# EAGLE design e-ink-display-v003 (EAGLE 7.3.0)
CNAME: e-ink-display; CREVISION: 0.0.3; DESIGNER: kennethlimcp

## Sheet 1 of 4: Power supply
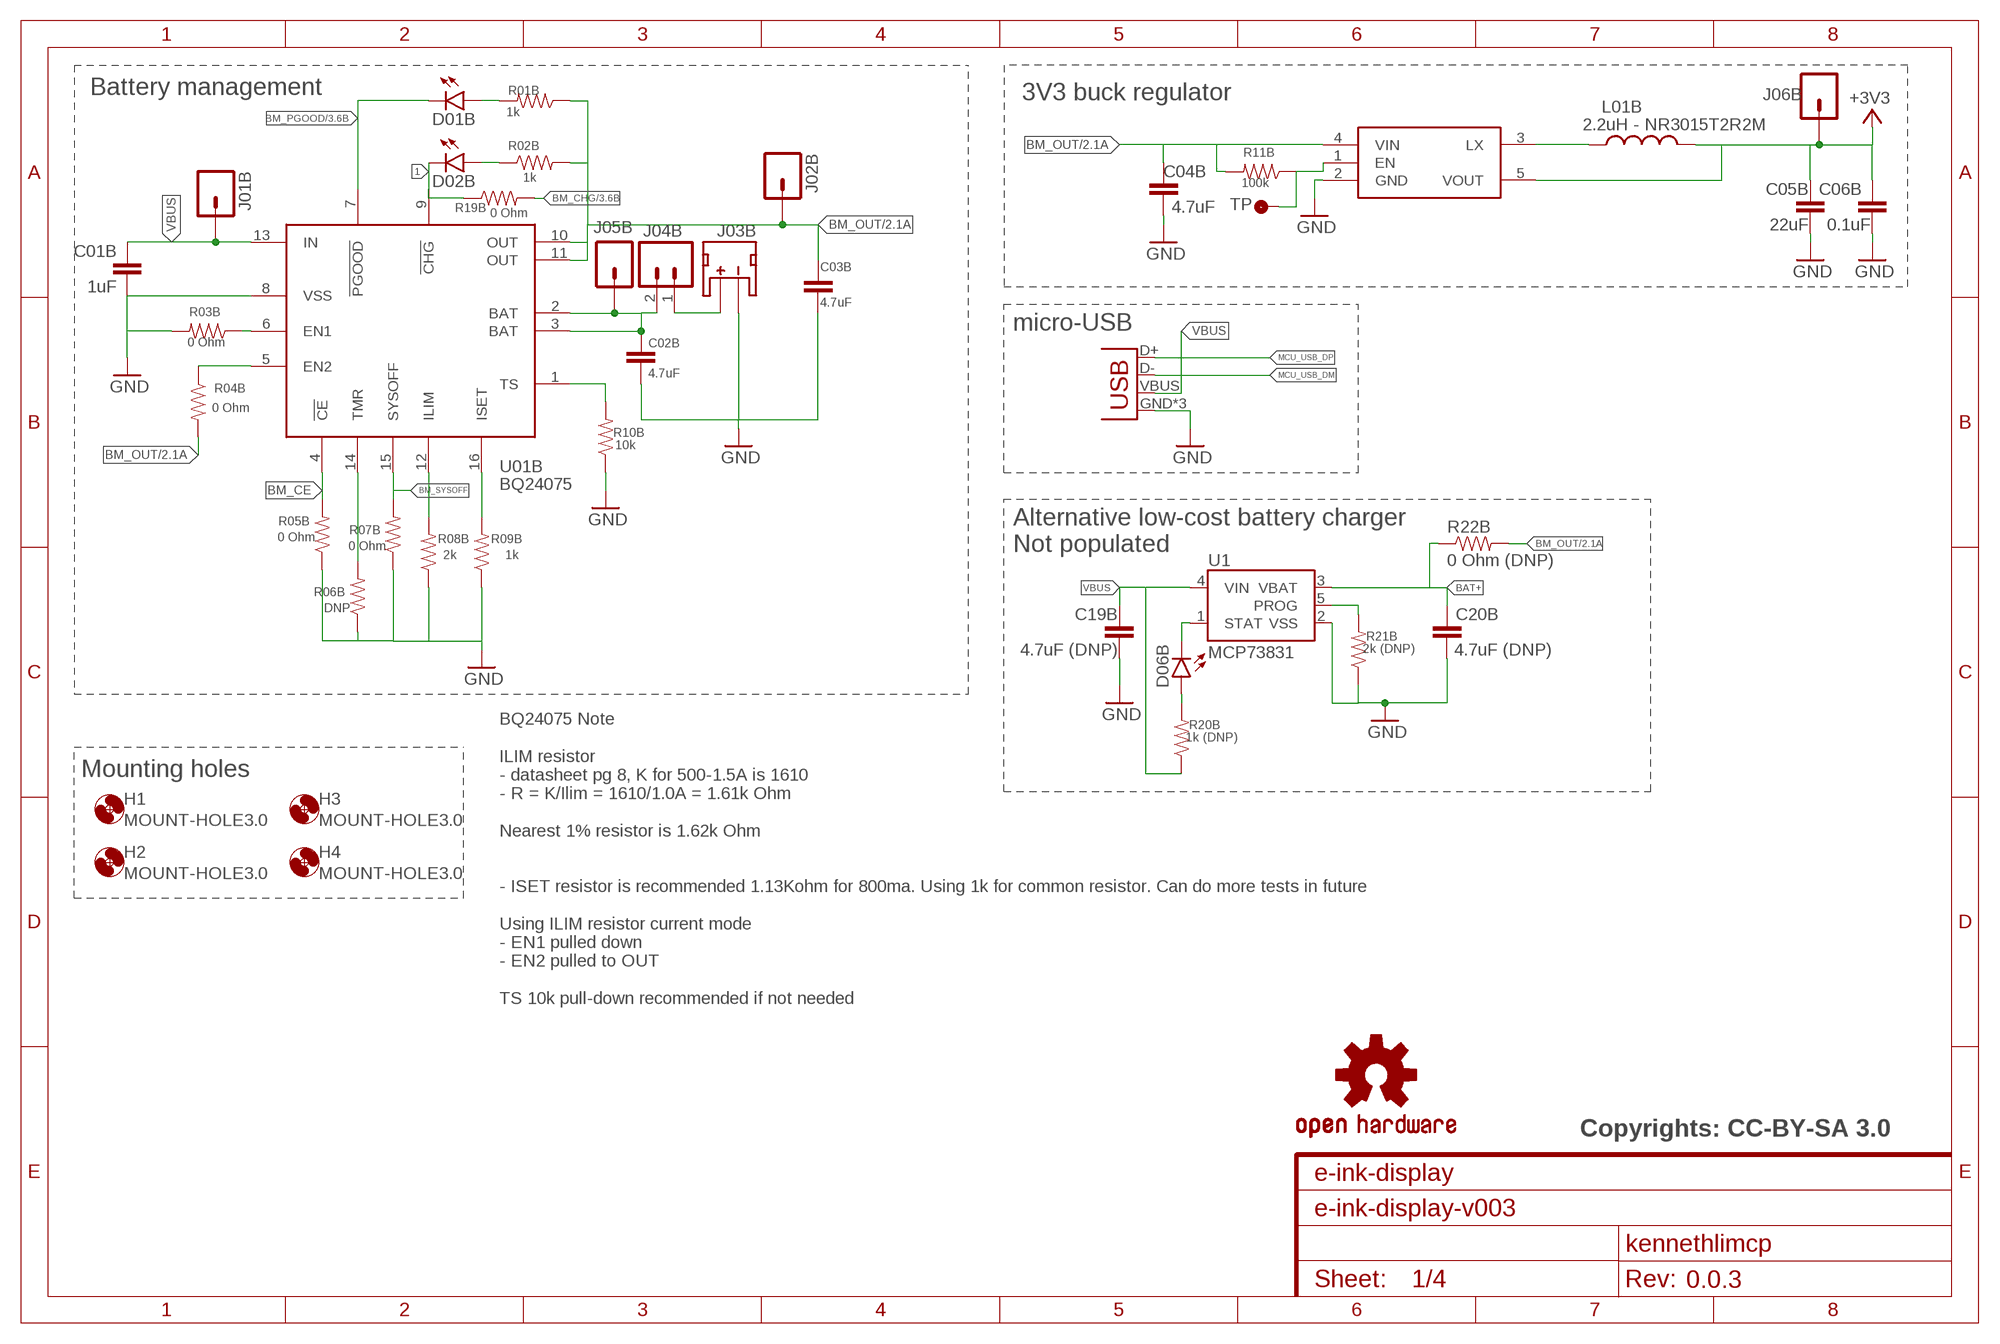
[diagram p0: schematic, sheet 1]

### Parts
C01B  1uF  CAP0603-CAP  [0603-CAP]
C02B  4.7uF  CAP0603-CAP  [0603-CAP]
C03B  4.7uF  CAP0603-CAP  [0603-CAP]
C04B  4.7uF  CAP0603-CAP  [0603-CAP]
C05B  22uF  CAP0603-CAP  [0603-CAP]
C06B  0.1uF  CAP0603-CAP  [0603-CAP]
C19B  4.7uF (DNP)  CAP0603-CAP  [0603-CAP]
C20B  4.7uF (DNP)  CAP0603-CAP  [0603-CAP]
D01B  LED0603  [LED-0603]
D02B  LED0603  [LED-0603]
D06B  LED0603  [LED-0603]
H1  MOUNT-HOLE3.0  [3,0]
H2  MOUNT-HOLE3.0  [3,0]
H3  MOUNT-HOLE3.0  [3,0]
H4  MOUNT-HOLE3.0  [3,0]
J01B  M01PTH  [1X01]
J02B  M01PTH  [1X01]
J03B  JST_2MM_MALE  [JST-2-SMD]
J04B  M02PTH  [1X02]
J05B  M01PTH  [1X01]
J06B  M01PTH  [1X01]
J07B  USBUSB-MICROB-SLOT-HOLE  [USB-MICROB-SLOT-HOLE]
L01B  2.2uH - NR3015T2R2M  INDUCTOR-SPARKFUNNR3015T4R7M  [INDUCTOR-NR3015]
LOGO1  OSHW-LOGOPAD  [OSHW-LOGO-M-PAD]
R01B  1k  RESISTOR0603-RES  [0603-RES]
R02B  1k  RESISTOR0603-RES  [0603-RES]
R03B  0 Ohm  RESISTOR0603-RES  [0603-RES]
R04B  0 Ohm  RESISTOR0603  [0603-RES]
R05B  0 Ohm  RESISTOR0603  [0603-RES]
R06B  DNP  RESISTOR0603  [0603-RES]
R07B  0 Ohm  RESISTOR0603  [0603-RES]
R08B  2k  RESISTOR0603  [0603-RES]
R09B  1k  RESISTOR0603-RES  [0603-RES]
R10B  10k  RESISTOR0603  [0603-RES]
R11B  100k  RESISTOR0603  [0603-RES]
R19B  0 Ohm  RESISTOR0603  [0603-RES]
R20B  1k (DNP)  RESISTOR0603  [0603-RES]
R21B  2k (DNP)  RESISTOR0603  [0603-RES]
R22B  0 Ohm (DNP)  RESISTOR1206  [1206]
TP01B  TP1  [TP35_BOT]
U1  MCP73831  [SOT23-5]
U01B  BQ24075  [QFN-16]
U02B  R8008-33  [SOT23-5]

### Nets
1: D02B.C R19B.1 U01B.9(!CHG)
+3V3: C05B.2 C06B.2 J06B.1 L01B.2 U02B.5(VOUT) ; also sheet 3,4
BAT+: C20B.2 J03B.2(+) J04B.1 R22B.1 U1.3(VBAT)
BM_BAT: C02B.2 J04B.2 J05B.1 U01B.2(BAT) U01B.3(BAT)
BM_CE: R05B.2 U01B.4(!CE)
BM_CHG: R19B.2 ; also sheet 3
BM_OUT: C03B.2 C04B.2 J02B.1 R01B.1 R02B.2 R04B.2 R11B.2 R22B.2 U01B.10(OUT) U01B.11(OUT) U02B.4(VIN) ; also sheet 2
BM_PGOOD: D01B.C U01B.7(!PGOOD) ; also sheet 3
BM_SYSOFF: R07B.2 U01B.15(SYSOFF)
GND: C01B.1 C02B.1 C03B.1 C04B.1 C05B.1 C06B.1 C19B.1 C20B.1 J03B.1(-) J07B.GND J07B.MT1(GND) J07B.MT2(GND) R03B.2 R05B.1 R06B.1 R07B.1 R08B.1 R09B.1 R10B.1 R21B.1 U1.2(VSS) U01B.8(VSS) U02B.2(GND) ; also sheet 2,3,4
MCU_USB_DM: J07B.D-
MCU_USB_DP: J07B.D+
N$4: R08B.2 U01B.12(ILIM)
N$9: R09B.2 U01B.16(ISET)
N$11: R04B.1 U01B.5(EN2)
N$12: R03B.1 U01B.6(EN1)
N$13: R06B.2 U01B.14(TMR)
N$15: R10B.2 U01B.1(TS)
N$17: D02B.A R02B.1
N$18: D01B.A R01B.2
N$19: R21B.2 U1.5(PROG)
N$21: R11B.1 TP01B.P$1(TP) U02B.1(EN)
N$23: L01B.1 U02B.3(LX)
N$30: D06B.C U1.1(STAT)
N$37: D06B.A R20B.2
VBUS: C01B.2 C19B.2 J01B.1 J07B.VBUS R20B.1 U1.4(VIN) U01B.13(IN)
Unconnected: J03B.NC1(PAD1) J03B.NC2(PAD2)

### Notes on the sheet
- Battery management | 3V3 buck regulator
- micro-USB
- Alternative low-cost battery charger
  Not populated
- Mounting holes
- BQ24075 Note
  
  ILIM resistor
  - datasheet pg 8, K for 500-1.5A is 1610
  - R = K/Ilim = 1610/1.0A = 1.61k Ohm
  
  Nearest 1% resistor is 1.62k Ohm
  
  
  - ISET resistor is recommended 1.13Kohm for 800ma. Using 1k for common resistor. Can do more tests in future
  
  Using ILIM resistor current mode
  - EN1 pulled down
  - EN2 pulled to OUT
  
  TS 10k pull-down recommended if not needed
- Copyrights: CC-BY-SA 3.0

## Sheet 2 of 4: e-ink power supply
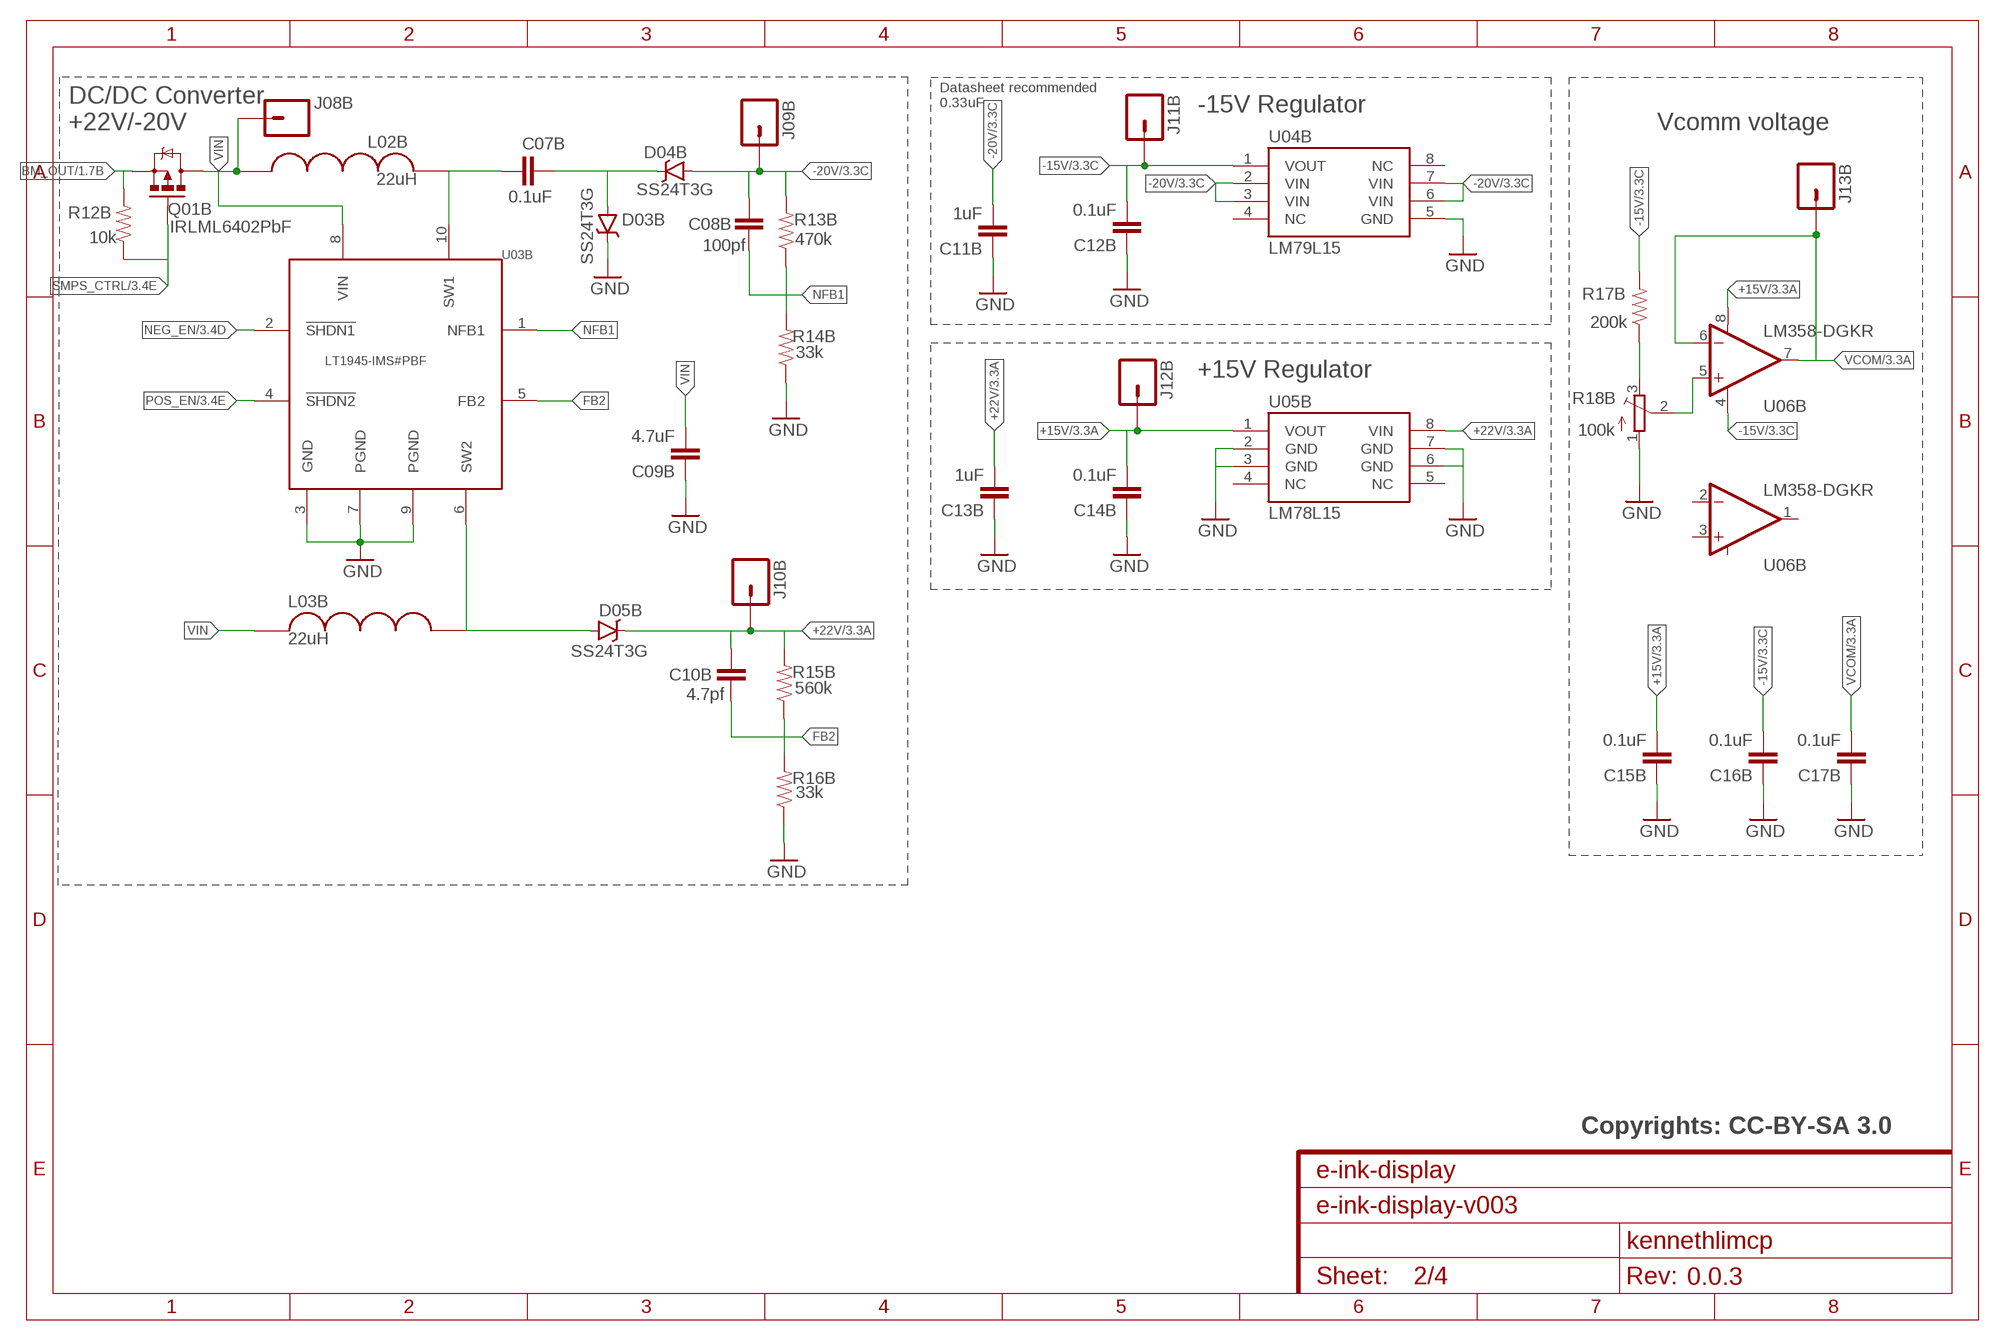
[diagram p1: schematic, sheet 2]

### Parts
C07B  0.1uF  CAP0603-CAP  [0603-CAP]
C08B  100pf  CAP0603-CAP  [0603-CAP]
C09B  4.7uF  CAP0603-CAP  [0603-CAP]
C10B  4.7pf  CAP0603-CAP  [0603-CAP]
C11B  1uF  CAP0603-CAP  [0603-CAP]
C12B  0.1uF  CAP0603-CAP  [0603-CAP]
C13B  1uF  CAP0603-CAP  [0603-CAP]
C14B  0.1uF  CAP0603-CAP  [0603-CAP]
C15B  0.1uF  CAP0603-CAP  [0603-CAP]
C16B  0.1uF  CAP0603-CAP  [0603-CAP]
C17B  0.1uF  CAP0603-CAP  [0603-CAP]
D03B  SS24T3G  [SMA-DIODE]
D04B  SS24T3G  [SMA-DIODE]
D05B  SS24T3G  [SMA-DIODE]
J08B  M01PTH  [1X01]
J09B  M01PTH  [1X01]
J10B  M01PTH  [1X01]
J11B  M01PTH  [1X01]
J12B  M01PTH  [1X01]
J13B  M01PTH  [1X01]
L02B  22uH  INDUCTOR  [4040(1515)]
L03B  22uH  INDUCTOR  [4040(1515)]
Q01B  IRLML6402PbF  MOSFET-PCHANNELSMD  [SOT23-3]
R12B  10k  RESISTOR0603  [0603-RES]
R13B  470k  RESISTOR0603  [0603-RES]
R14B  33k  RESISTOR0603  [0603-RES]
R15B  560k  RESISTOR0603  [0603-RES]
R16B  33k  RESISTOR0603  [0603-RES]
R17B  200k  RESISTOR0603  [0603-RES]
R18B  100k  TRIMPOTTC33X  [TC33X]
U03B  LT1945-IMS#PBF  [MSOP-10]
U04B  LM79L15  [SO08]
U05B  LM78L15  [SO08]
U06B  LM358-DGKR  [MSOP-8]

### Nets
+15V: C14B.2 C15B.2 J12B.1 U05B.1(VOUT) U06B.8(V+) ; also sheet 3
+22V: C10B.2 C13B.2 D05B.C J10B.1 R15B.2 U05B.8(VIN) ; also sheet 3
-15V: C12B.2 C16B.2 J11B.1 R17B.2 U04B.1(VOUT) U06B.4(V-) ; also sheet 3
-20V: C08B.2 C11B.2 D04B.A J09B.1 R13B.2 U04B.2(VIN) U04B.3(VIN) U04B.6(VIN) U04B.7(VIN) ; also sheet 3
BM_OUT: Q01B.2(S) R12B.2 ; also sheet 1
FB2: C10B.1 R15B.1 R16B.2 U03B.5(FB2)
GND: C09B.1 C11B.1 C12B.1 C13B.1 C14B.1 C15B.1 C16B.1 C17B.1 D03B.C R14B.1 R16B.1 R18B.1(A) U03B.3(GND) U03B.7(PGND) U03B.9(PGND) U04B.5(GND) U05B.2(GND) U05B.3(GND) U05B.6(GND) U05B.7(GND) ; also sheet 1,3,4
N$2: C07B.1 L02B.P$2 U03B.10(SW1)
N$3: C07B.2 D03B.A D04B.C
N$6: R18B.2(S) U06B.5(+IN2)
N$7: R17B.1 R18B.3(E)
N$8: D05B.A L03B.P$2 U03B.6(SW2)
NEG_EN: U03B.2(!SHDN1) ; also sheet 3
NFB1: C08B.1 R13B.1 R14B.2 U03B.1(NFB1)
POS_EN: U03B.4(!SHDN2) ; also sheet 3
SMPS_CTRL: Q01B.1(G) R12B.1 ; also sheet 3
VCOM: C17B.2 J13B.1 U06B.6(-IN2) U06B.7(OUT2) ; also sheet 3
VIN: C09B.2 J08B.1 L02B.P$1 L03B.P$1 Q01B.3(D) U03B.8(VIN)
Unconnected: U04B.4(NC) U04B.8(NC) U05B.4(NC) U05B.5(NC) U06B.1(OUT1) U06B.2(-IN1) U06B.3(+IN1)

### Notes on the sheet
- Datasheet recommended
  0.33uF
- -15V Regulator
- DC/DC Converter
  +22V/-20V
- Vcomm voltage
- +15V Regulator
- Copyrights: CC-BY-SA 3.0

## Sheet 3 of 4: e-ink display & MCU
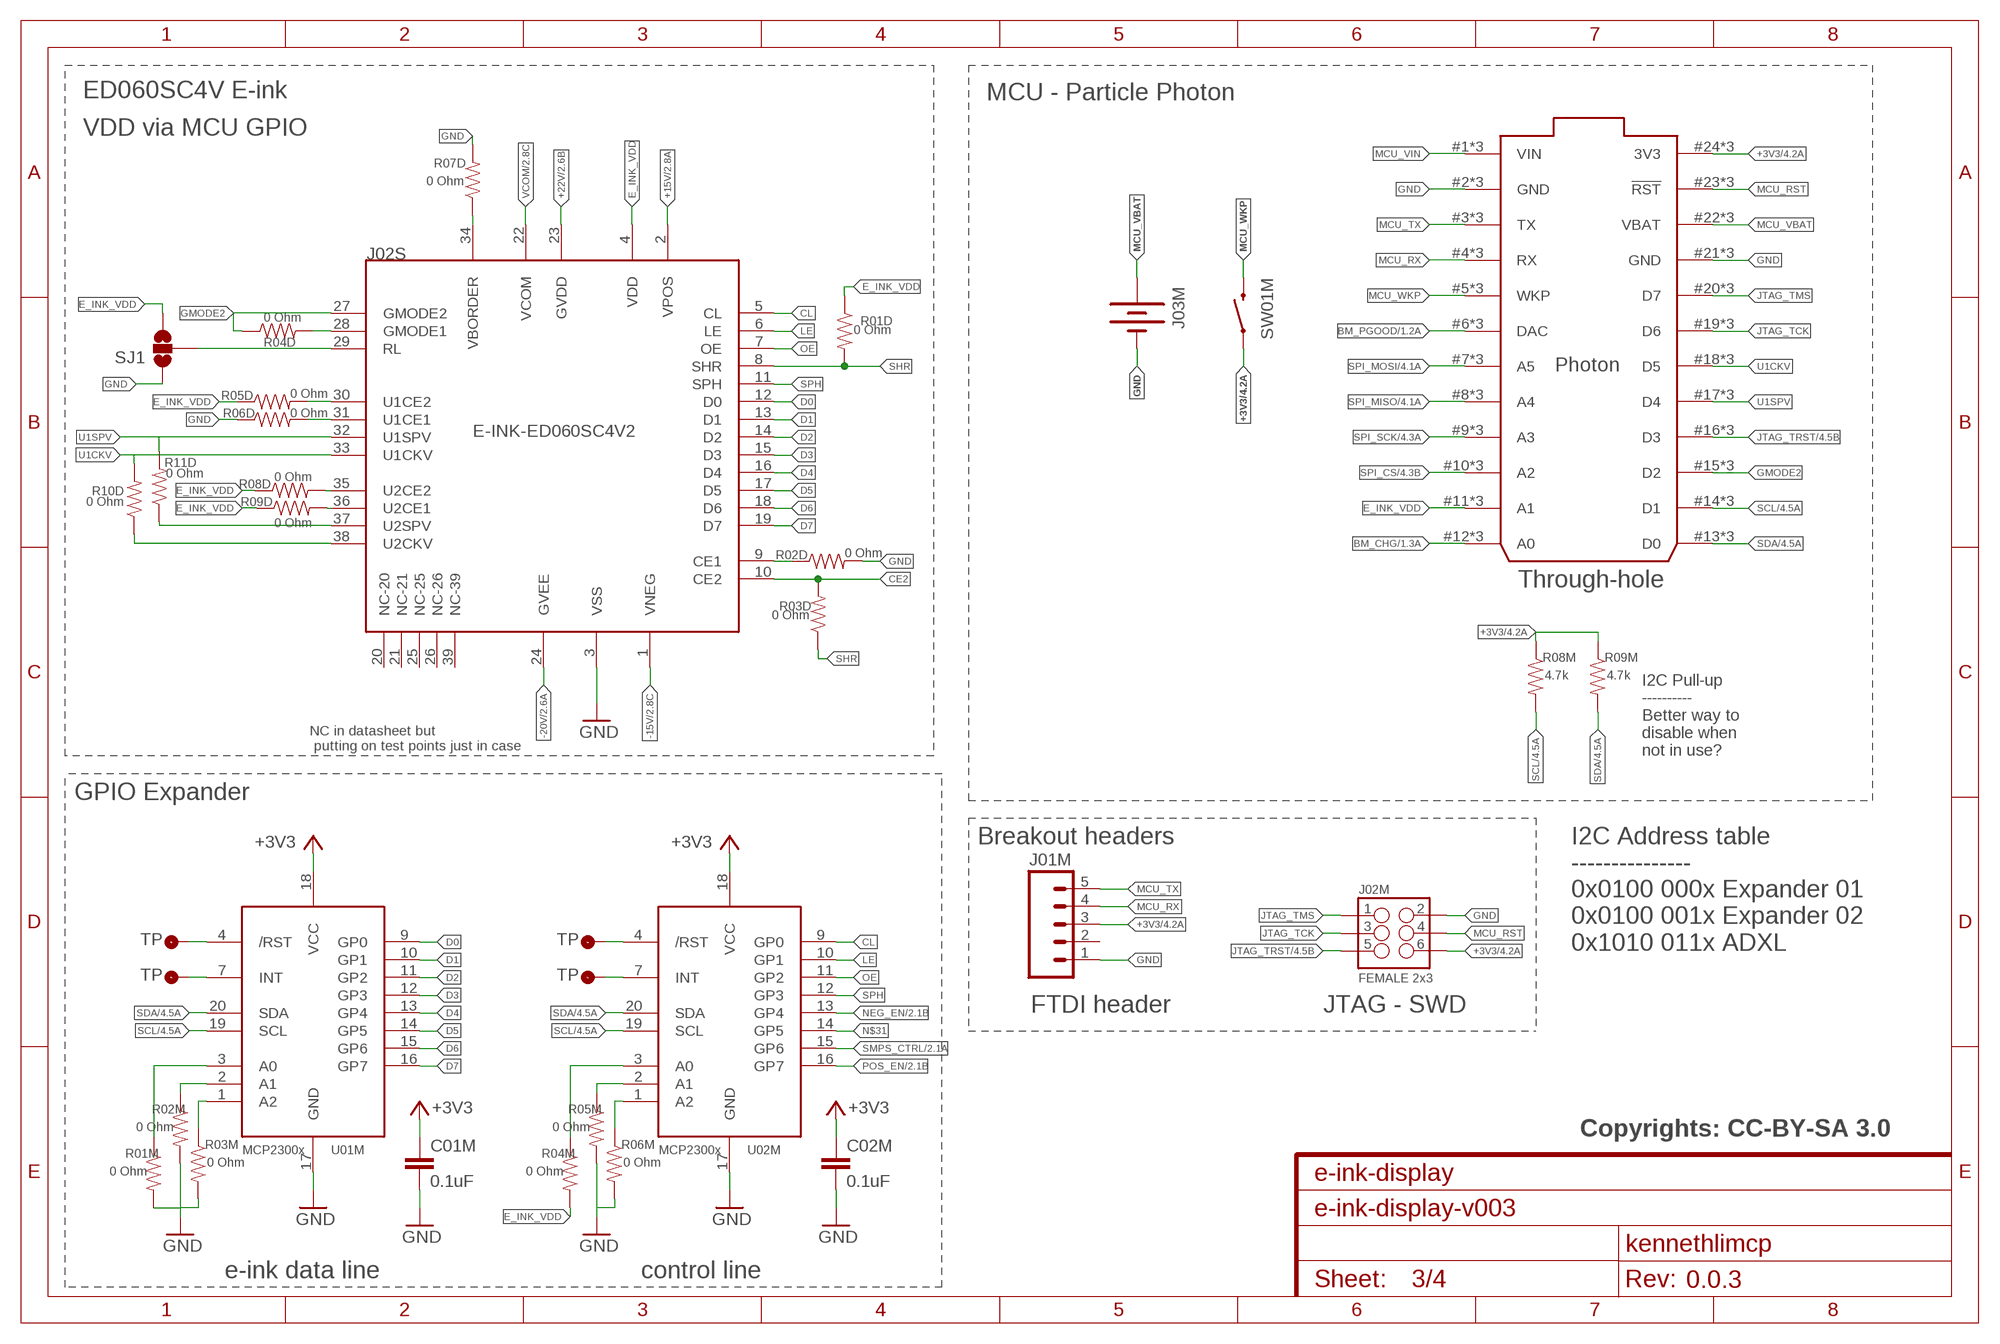
[diagram p2: schematic, sheet 3]

### Parts
C01M  0.1uF  CAP0603-CAP  [0603-CAP]
C02M  0.1uF  CAP0603-CAP  [0603-CAP]
J01M  M05PTH  [1X05]
J02M  FEMALE 2x3  M03X2FEMALE  [2X3]
J02S  E-INK-ED060SC4V2  [FPC-0.3-39]
J03M  BATTERY20PTH  [BATTCOM_20MM_PTH]
R01D  0 Ohm  RESISTOR0603-RES  [0603-RES]
R01M  0 Ohm  RESISTOR0603-RES  [0603-RES]
R02D  0 Ohm  RESISTOR0603-RES  [0603-RES]
R02M  0 Ohm  RESISTOR0603-RES  [0603-RES]
R03D  0 Ohm  RESISTOR0603-RES  [0603-RES]
R03M  0 Ohm  RESISTOR0603-RES  [0603-RES]
R04D  0 Ohm  RESISTOR0603-RES  [0603-RES]
R04M  0 Ohm  RESISTOR0603-RES  [0603-RES]
R05D  0 Ohm  RESISTOR0603-RES  [0603-RES]
R05M  0 Ohm  RESISTOR0603-RES  [0603-RES]
R06D  0 Ohm  RESISTOR0603-RES  [0603-RES]
R06M  0 Ohm  RESISTOR0603-RES  [0603-RES]
R07D  0 Ohm  RESISTOR0603-RES  [0603-RES]
R08D  0 Ohm  RESISTOR0603-RES  [0603-RES]
R08M  4.7k  RESISTOR0603-RES  [0603-RES]
R09D  0 Ohm  RESISTOR0603-RES  [0603-RES]
R09M  4.7k  RESISTOR0603-RES  [0603-RES]
R10D  0 Ohm  RESISTOR0603-RES  [0603-RES]
R11D  0 Ohm  RESISTOR0603-RES  [0603-RES]
SJ1  SOLDERJUMPER_2WAYT  [SJ_2]
SW01M  SWITCH-MOMENTARY-2PTH  [TACTILE-PTH]
U01M  MCP2300X/QFN  [QFN-20(4X4)]
U02M  MCP2300X/QFN  [QFN-20(4X4)]
U03M  PHOTON_WITH_STACKABLE_HEADERS  [PHOTON_STACKABLE]
U$1  TP1  [TP35_BOT]
U$2  TP1  [TP35_BOT]
U$3  TP1  [TP35_BOT]
U$4  TP1  [TP35_BOT]

### Nets
+3V3: C01M.1 C02M.1 J01M.3 J02M.6 R08M.1 R09M.1 SW01M.1 U01M.18(VCC) U02M.18(VCC) U03M.24(3V3) U03M.#24(3V3) U03M.@24(3V3) ; also sheet 1,4
+15V: J02S.2(VPOS) ; also sheet 2
+22V: J02S.23(GVDD) ; also sheet 2
-15V: J02S.1(VNEG) ; also sheet 2
-20V: J02S.24(GVEE) ; also sheet 2
BM_CHG: U03M.12(A0) U03M.#12(A0) U03M.@12(A0) ; also sheet 1
BM_PGOOD: U03M.6(DAC) U03M.#6(DAC) U03M.@6(DAC) ; also sheet 1
CE2: J02S.10(CE2) R03D.2
CL: J02S.5(CL) U02M.9(GP0)
D0: J02S.12(D0) U01M.9(GP0)
D1: J02S.13(D1) U01M.10(GP1)
D2: J02S.14(D2) U01M.11(GP2)
D3: J02S.15(D3) U01M.12(GP3)
D4: J02S.16(D4) U01M.13(GP4)
D5: J02S.17(D5) U01M.14(GP5)
D6: J02S.18(D6) U01M.15(GP6)
D7: J02S.19(D7) U01M.16(GP7)
E_INK_VDD: J02S.4(VDD) R01D.1 R04M.2 R05D.1 R08D.1 R09D.1 SJ1.3 U03M.11(A1) U03M.#11(A1) U03M.@11(A1)
GMODE2: J02S.27(GMODE2) R04D.1 U03M.15(D2) U03M.#15(D2) U03M.@15(D2)
GND: C01M.2 C02M.2 J01M.1 J02M.2 J02S.3(VSS) J03M.2(-) R01M.2 R02D.2 R02M.2 R03M.2 R05M.2 R06D.1 R06M.2 R07D.2 SJ1.1 U01M.17(GND) U02M.17(GND) U03M.2(GND) U03M.21(GND) U03M.#2(GND) U03M.#21(GND) U03M.@2(GND) U03M.@21(GND) ; also sheet 1,2,4
JTAG_TCK: J02M.3 U03M.19(D6) U03M.#19(D6) U03M.@19(D6)
JTAG_TMS: J02M.1 U03M.20(D7) U03M.#20(D7) U03M.@20(D7)
JTAG_TRST: J02M.5 U03M.16(D3) U03M.#16(D3) U03M.@16(D3) ; also sheet 4
LE: J02S.6(LE) U02M.10(GP1)
MCU_RST: J02M.4 U03M.23(!RST) U03M.#23(!RST) U03M.@23(!RST)
MCU_RX: J01M.4 U03M.4(RX) U03M.#4(RX) U03M.@4(RX)
MCU_TX: J01M.5 U03M.3(TX) U03M.#3(TX) U03M.@3(TX)
MCU_VBAT: J03M.1(+) U03M.22(VBAT) U03M.#22(VBAT) U03M.@22(VBAT)
MCU_VIN: U03M.1(VIN) U03M.#1(VIN) U03M.@1(VIN)
MCU_WKP: SW01M.3 U03M.5(WKP) U03M.#5(WKP) U03M.@5(WKP)
N$1: J02S.28(GMODE1) R04D.2
N$5: J02S.31(U1CE1) R06D.2
N$14: U01M.4(/RST) U$1.P$1(TP)
N$16: U01M.7(INT) U$2.P$1(TP)
N$20: U02M.4(/RST) U$3.P$1(TP)
N$22: U02M.7(INT) U$4.P$1(TP)
N$24: R03M.1 U01M.1(A2)
N$25: R01M.1 U01M.3(A0)
N$26: J02S.35(U2CE2) R08D.2
N$27: J02S.36(U2CE1) R09D.2
N$28: J02S.9(CE1) R02D.1
N$29: J02S.34(VBORDER) R07D.1
N$31: U02M.14(GP5)
N$32: R06M.1 U02M.1(A2)
N$33: R05M.1 U02M.2(A1)
N$34: R04M.1 U02M.3(A0)
N$35: R02M.1 U01M.2(A1)
NEG_EN: U02M.13(GP4) ; also sheet 2
OE: J02S.7(OE) U02M.11(GP2)
POS_EN: U02M.16(GP7) ; also sheet 2
RL: J02S.29(RL) SJ1.2
SCL: R08M.2 U01M.19(SCL) U02M.19(SCL) U03M.14(D1) U03M.#14(D1) U03M.@14(D1) ; also sheet 4
SDA: R09M.2 U01M.20(SDA) U02M.20(SDA) U03M.13(D0) U03M.#13(D0) U03M.@13(D0) ; also sheet 4
SHR: J02S.8(SHR) R01D.2 R03D.1
SMPS_CTRL: U02M.15(GP6) ; also sheet 2
SPH: J02S.11(SPH) U02M.12(GP3)
SPI_CS: U03M.10(A2) U03M.#10(A2) U03M.@10(A2) ; also sheet 4
SPI_MISO: U03M.8(A4) U03M.#8(A4) U03M.@8(A4) ; also sheet 4
SPI_MOSI: U03M.7(A5) U03M.#7(A5) U03M.@7(A5) ; also sheet 4
SPI_SCK: U03M.9(A3) U03M.#9(A3) U03M.@9(A3) ; also sheet 4
U1CE2: J02S.30(U1CE2) R05D.2
U1CKV: J02S.33(U1CKV) R10D.2 U03M.18(D5) U03M.#18(D5) U03M.@18(D5)
U1SPV: J02S.32(U1SPV) R11D.2 U03M.17(D4) U03M.#17(D4) U03M.@17(D4)
U2CKV: J02S.38(U2CKV) R10D.1
U2SPV: J02S.37(U2SPV) R11D.1
VCOM: J02S.22(VCOM) ; also sheet 2
Unconnected: J01M.2 J02S.20(NC-20) J02S.21(NC-21) J02S.25(NC-25) J02S.26(NC-26) J02S.39(NC-39)

### Notes on the sheet
- MCU - Particle Photon
- ED060SC4V E-ink
  
  VDD via MCU GPIO
- Through-hole
- NC in datasheet but
   putting on test points just in case
- I2C Pull-up
  ----------
  Better way to 
  disable when 
  not in use?
- GPIO Expander
- Breakout headers
- I2C Address table
  ---------------
  0x0100 000x Expander 01
  0x0100 001x Expander 02
  0x1010 011x ADXL
- FTDI header | JTAG - SWD
- Copyrights: CC-BY-SA 3.0
- e-ink data line | control line

## Sheet 4 of 4: Peripherals
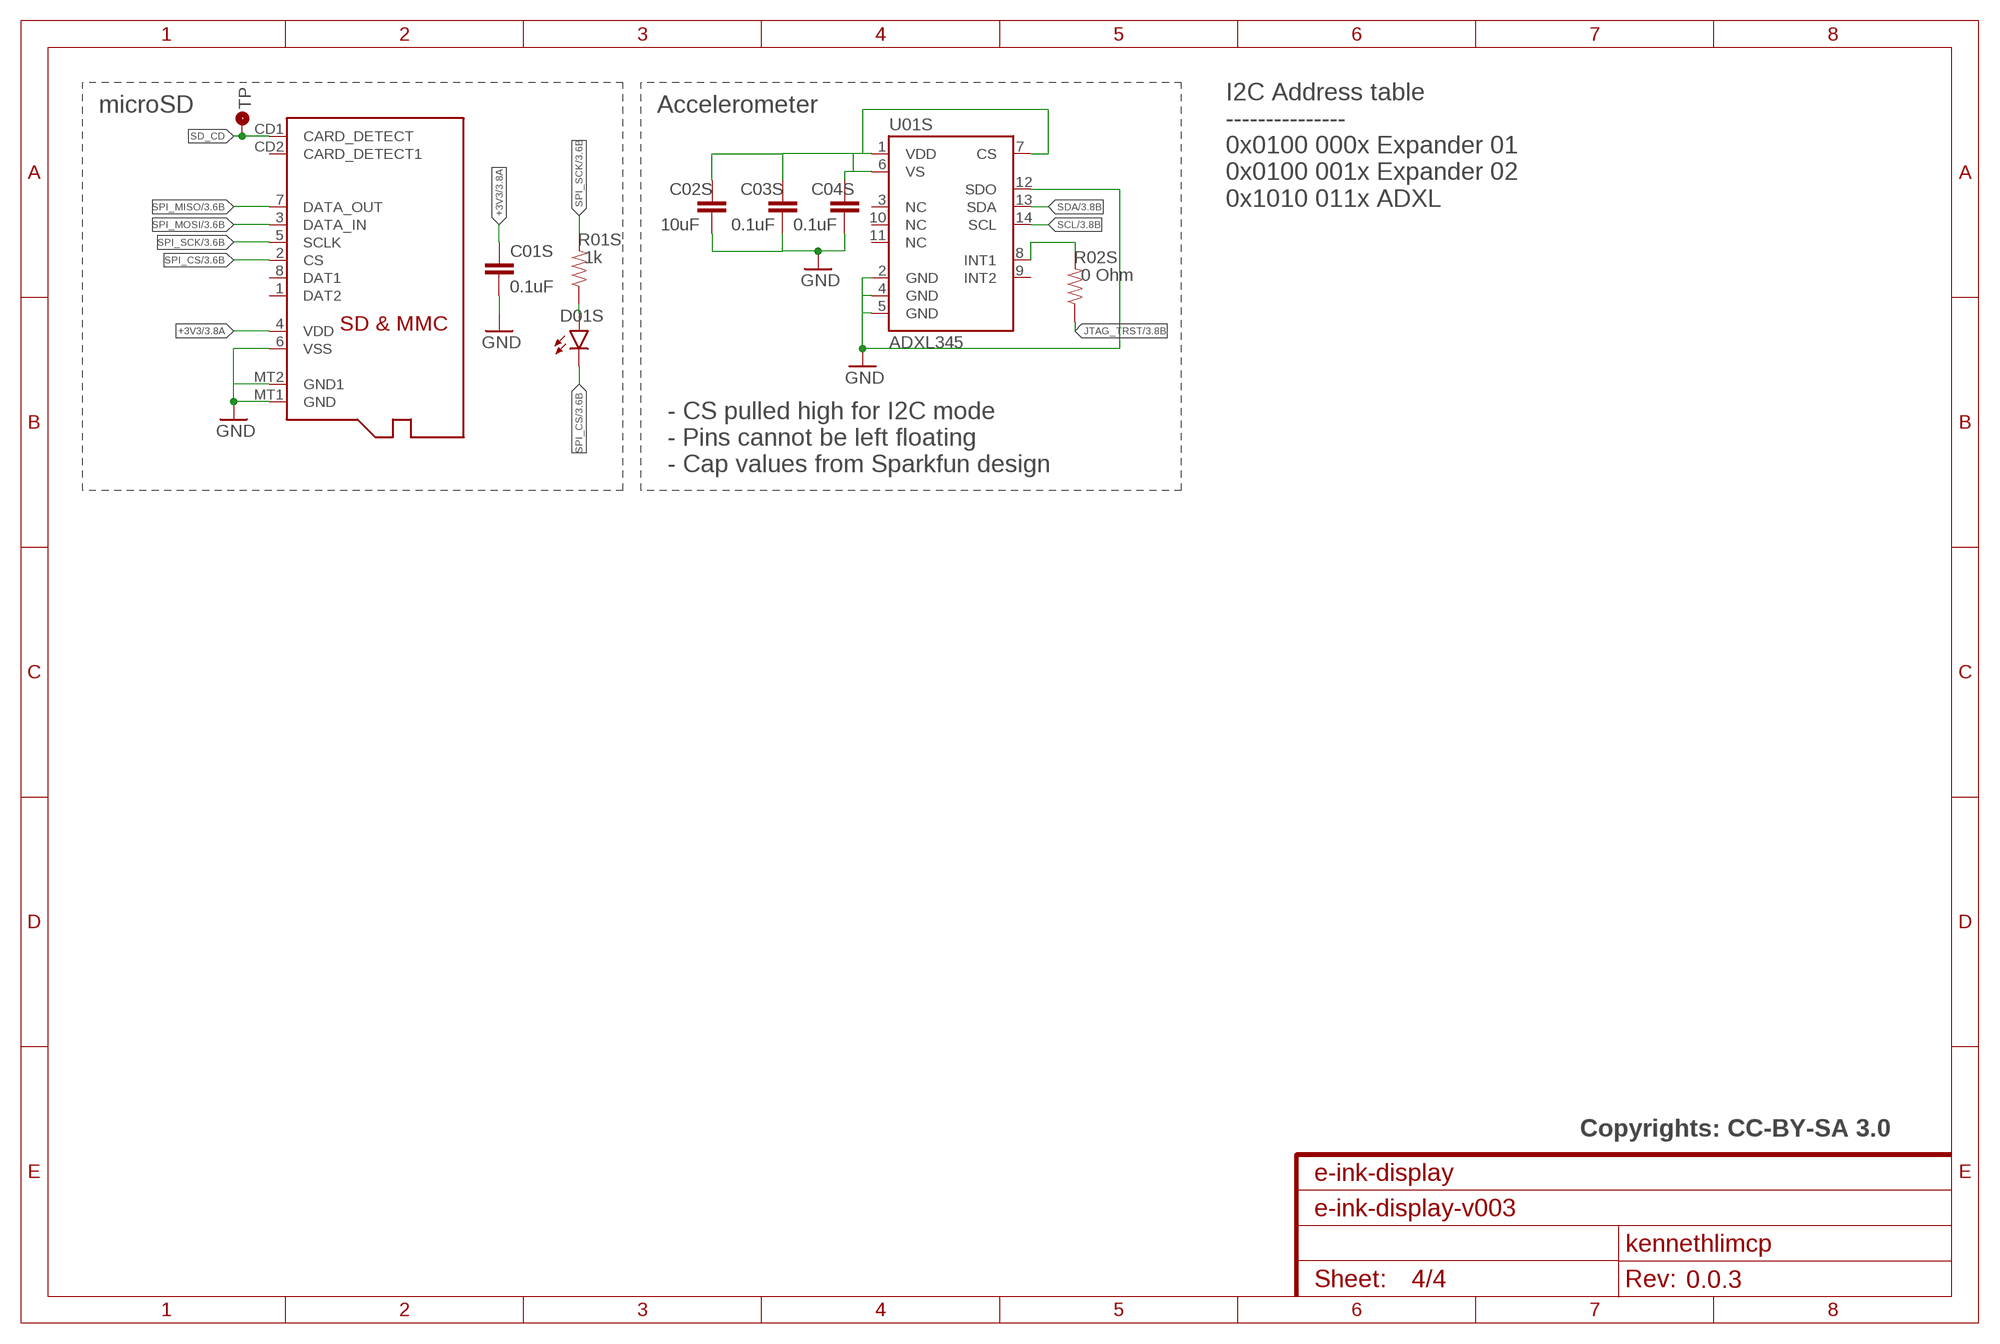
[diagram p3: schematic, sheet 4]

### Parts
C01S  0.1uF  CAP0603-CAP  [0603-CAP]
C02S  10uF  CAP0603-CAP  [0603-CAP]
C03S  0.1uF  CAP0603-CAP  [0603-CAP]
C04S  0.1uF  CAP0603-CAP  [0603-CAP]
D01S  LED0603  [LED-0603]
J01S  MICROSD  [MICROSD]
R01S  1k  RESISTOR0603-RES  [0603-RES]
R02S  0 Ohm  RESISTOR0603  [0603-RES]
U01S  ADXL345  [LGA14]
U$5  TP3  [TP60_BOT]

### Nets
+3V3: C01S.1 J01S.4(VDD) ; also sheet 1,3
GND: C01S.2 C02S.2 C03S.2 C04S.2 J01S.6(VSS) J01S.MT1(GND) J01S.MT2(GND1) U01S.2(GND) U01S.4(GND) U01S.5(GND) U01S.12(SDO) ; also sheet 1,2,3
JTAG_TRST: R02S.1 ; also sheet 3
N$10: R02S.2 U01S.8(INT1)
N$36: C02S.1 C03S.1 C04S.1 U01S.1(VDD) U01S.6(VS) U01S.7(CS)
R01S: D01S.A R01S.1
SCL: U01S.14(SCL) ; also sheet 3
SD_CD: J01S.CD1(CARD_DETECT) U$5.P$1(TP)
SDA: U01S.13(SDA) ; also sheet 3
SPI_CS: D01S.C J01S.2(CS) ; also sheet 3
SPI_MISO: J01S.7(DATA_OUT) ; also sheet 3
SPI_MOSI: J01S.3(DATA_IN) ; also sheet 3
SPI_SCK: J01S.5(SCLK) R01S.2 ; also sheet 3
Unconnected: J01S.1(DAT2) J01S.8(DAT1) J01S.CD2(CARD_DETECT1) U01S.3(NC) U01S.9(INT2) U01S.10(NC) U01S.11(NC)

### Notes on the sheet
- microSD | Accelerometer
- I2C Address table
  ---------------
  0x0100 000x Expander 01
  0x0100 001x Expander 02
  0x1010 011x ADXL
- - CS pulled high for I2C mode
  - Pins cannot be left floating
  - Cap values from Sparkfun design
- Copyrights: CC-BY-SA 3.0

## Library data of the parts
C01B C01M C01S C02B C02M C02S C03B C03S C04B C04S C05B C06B C07B C08B C09B C10B C11B C12B C13B C14B C15B C16B C17B C19B C20B = SparkFun-Capacitors:CAP: Capacitor Standard 0603 ceramic capacitor, and 0.1" leaded capacitor.
D01B D01S D02B D06B = SparkFun-LED:LED: LEDs Standard schematic elements and footprints for 5mm, 3mm, 1206, and 0603 sized LEDs. 5mm - Spark Fun Electronics SKU : COM-00529 (and others)
D03B D04B D05B = kennethlimcp:SS24T3G: SS24T3G, Schottky diode 40V, 1A, Vf 500mV Package: DO-214AA
H1-H4 = holes:MOUNT-HOLE: MOUNTING HOLE with drill center marker
J01B J02B J05B J06B J08B J09B J10B J11B J12B J13B = SparkFun-Connectors:M01: Header 1 Standard 1-pin 0.1" header. Use with straight break away headers (SKU : PRT-00116), right angle break away headers (PRT-00553), swiss pins (PRT-00743), machine pins (PRT-00117), and female headers (PRT-00115).
J01M = SparkFun-Connectors:M05: Header 5 Standard 5-pin 0.1" header. Use with straight break away headers (SKU : PRT-00116), right angle break away headers (PRT-00553), swiss pins (PRT-00743), machine pins (PRT-00117), and female headers (PRT-00115). Molex polarized connector foot print use with SKU : PRT-08230 with associated crimp pins and housings.
J01S = adafruit:MICROSD: Micro-SD / Transflash card holder with SPI pinout For the 3M # 2908-05WB-MG and/or 4UCON #19656 push-push type
J02M = SparkFun-Connectors:M03X2: 2x3 .1" header. Shrouded, with keying- CONN-10681 SMT- CONN-11415 Pogo pins- HW-11044; PROD_ID: CONN-11566
J02S = kennethlimcp:E-INK-ED060SC4V2
J03B = SparkFun-Connectors:JST_2MM_MALE: Mates to single-cell LiPo batteries. CONN-11443 Now with smashable polarity marks!; BTM_NEG: -; BTM_POS: +; PROD_ID: CONN-11443; TOP_NEG: -; TOP_POS: +
J03M = SparkFun-Electromechanical:BATTERY: Battery Holders Various common sizes : AA, AAA, 18650 (PRT-12895), 20mm coin cell and 12mm coin cell. 20MM_4LEGS, BATT-10373
J04B = SparkFun-Connectors:M02: Standard 2-pin 0.1" header. Use with - straight break away headers ( PRT-00116) - right angle break away headers (PRT-00553) - swiss pins (PRT-00743) - machine pins (PRT-00117) - female headers (PRT-00115) Molex polarized connector foot print use with: PRT-08233 with associated crimp pins and housings. 2.54_SCREWTERM for use with PRT-10571. 3.5mm Screw Terminal footprints for PRT-08084 5mm Screw Terminal footprints for use with PRT-08432
J07B = Spark:USB
L01B = Spark:INDUCTOR-SPARKFUN: Inductors Basic Inductor/Choke - 0603 and 1206. Footprints are not proven and vary greatly between part numbers. SRN6045- 33uH, 20% 1.4A; NR3015T4R7M: 4.7uH
L02B L03B = kennethlimcp:INDUCTOR
LOGO1 = kennethlimcp:OSHW-LOGO: Open Source Hardware Logo This logo indicates the piece of hardware it is found on incorporates a OSHW license and/or adheres to the definition of open source hardware found here: http://freedomdefined.org/OSHW
Q01B = SparkFun-DiscreteSemi:MOSFET-PCHANNEL: Generic PMOSFET IRLML2244 - TRANS-11153 (SOT-23 -20V -4.3A) (1.Gate 2.Source 3.Drain) FQP27P06 - COM-10349 <http://www.sparkfun.com/products/10349> (TO-220 -60V -27A) (1.Gate 2.Source 3.Drain)
R01B R01S R02B R02S R03B R04B R05B R06B R07B R08B R09B R10B R11B R12B R13B R14B R15B R16B R17B R19B R20B R21B R22B = SparkFun-Resistors:RESISTOR: Resistor Basic schematic elements and footprints for 0603, 1206, and PTH resistors.
R01D R01M R02D R02M R03D R03M R04D R04M R05D R05M R06D R06M R07D R08D R08M R09D R09M R10D R11D = SparkFun-Passives:RESISTOR: Resistor Basic schematic elements and footprints for 0603, 1206, and PTH resistors.
R18B = adafruit:TRIMPOT: SMT trimmer potentiometer part number TC33X http://www.ladyada.net/library/eagle
SJ1 = SparkFun-Retired:SOLDERJUMPER_2WAY: Solder Jumper 2 way solder jumper
SW01M = SparkFun-Electromechanical:SWITCH-MOMENTARY-2: Various NO switches- pushbuttons, reed, etc; PROD_ID: SWCH-08441
TP01B U$1-U$5 = Spark:TP: Test Points of all sizes and shapes
U1 = SparkFun-PowerIC:MCP73831: Miniature single cell, fully integrated Li-Ion, Li-polymer charge management controller http://ww1.microchip.com/downloads/en/DeviceDoc/20001984g.pdf IC-09995; PROD_ID: IC-09995
U01B = kennethlimcp:BQ2407: 1.5-A USB-Friendly Li-Ion Battery Charger and Power-Path Management IC Series: bq24072, bq24073, bq24074, bq24075, bq24079
U01M U02M = kennethlimcp:MCP2300X: MCP23008 Inexpensive i2c i/o expander - 8 general purpose i/o pins with optional pullups
U01S = SparkFun-Sensors:ADXL345: 3-axis SPI/I2C 2/4/8/16g accelerometer
U02B = Spark:R8008-33
U03B = kennethlimcp:LT1945: LT1945 36V switch, 350mA, Dual micropower DC/DC converter
U03M = Spark:PHOTON
U04B = kennethlimcp:LM79L15: LM79L15, SOIC-8
U05B = kennethlimcp:LM78L15: LM78L15, SOIC-8
U06B = kennethlimcp:LM358: LM358, two independent, high-gain, Wide Supply Ranges frequency-compensated operational amplifiers MSOP-8

## Net classes
0 default: clearance 0.205 mm

## Board
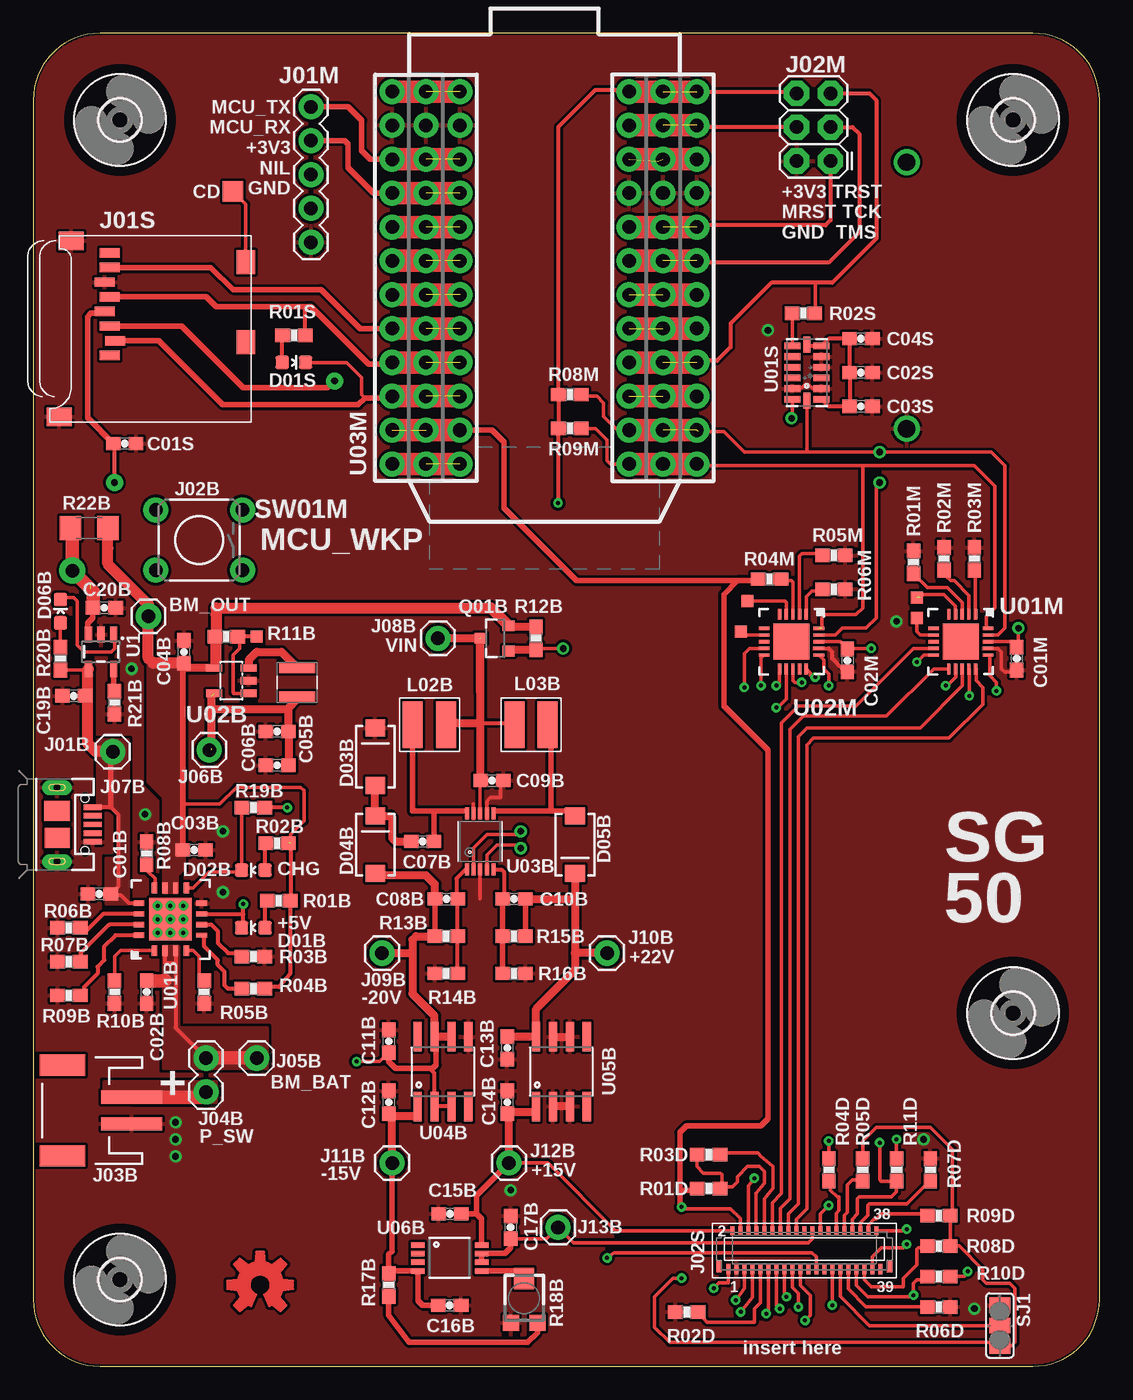
[diagram p4: board, top side]
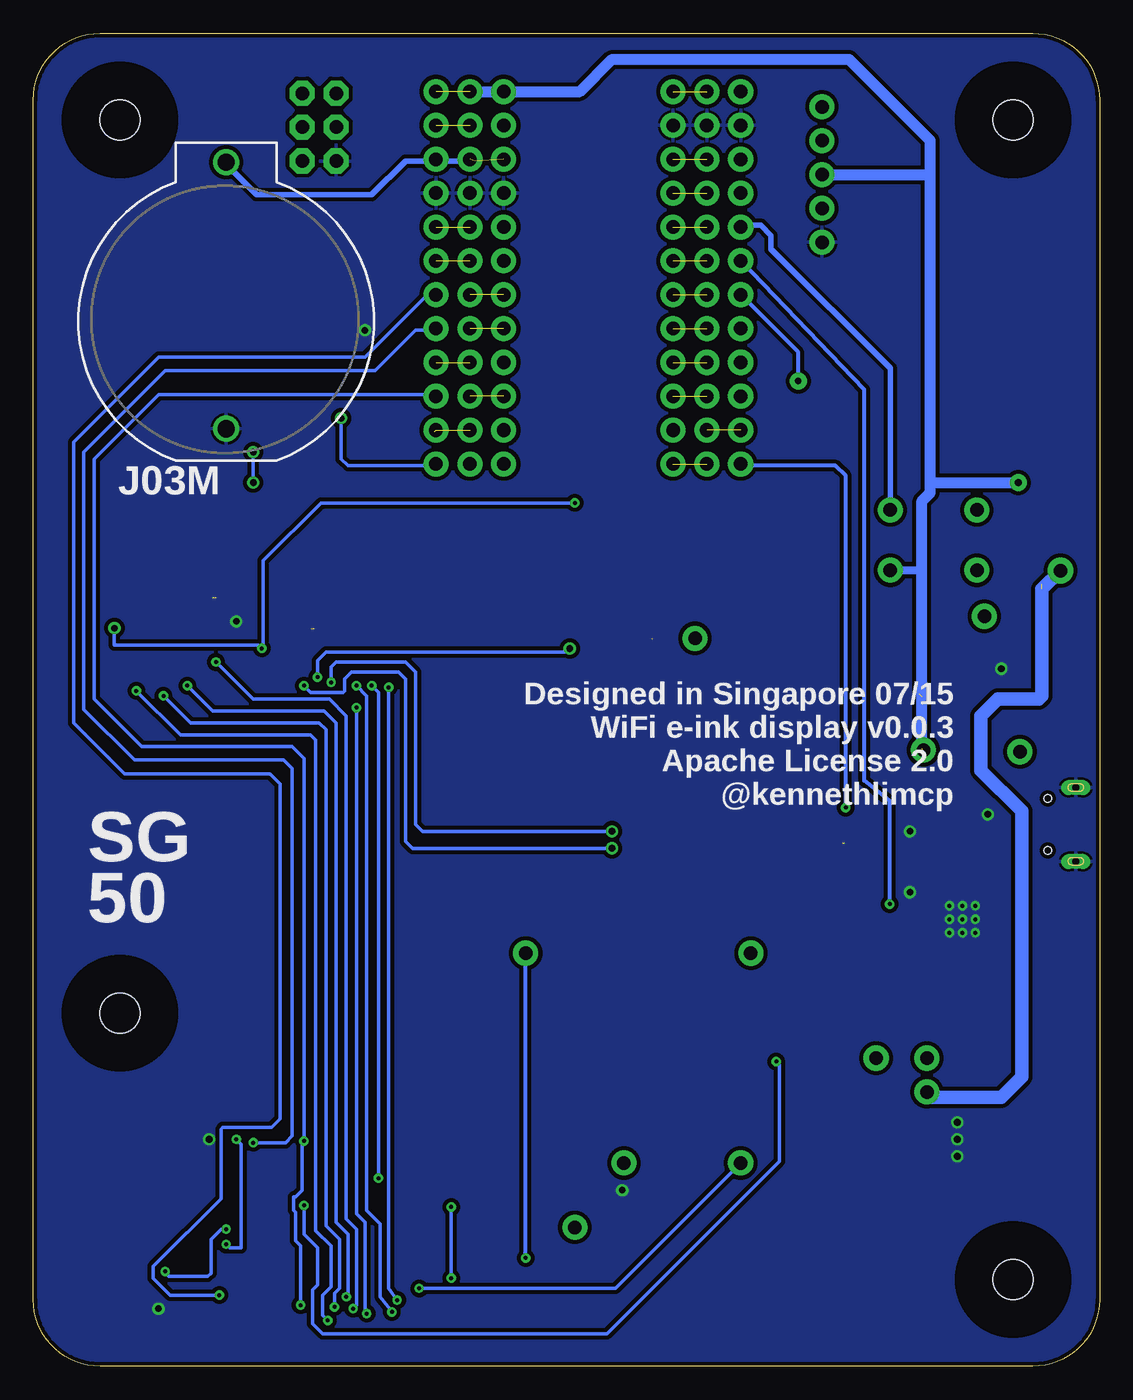
[diagram p5: board, bottom side, seen from below]

Size 80 x 100 mm. Coordinates in mm from the lower left corner, seen from the top.
Outline: 0,95 0,5 arc90 5,0 75,0 arc90 80,5 80,95 arc90 75,100 5,100 arc90 0,95
Copper layers (1+2*15+16): Top 0.018mm / dielectric 0.195mm / Route2 0.035mm / dielectric 1.1mm / Route15 0.035mm / dielectric 0.195mm / Bottom 0.018mm
Design rules "spark-4layer": minimum track width 6mil, minimum drill 0.3mm, track to track 6mil, track to pad 6mil, pad to pad 6mil, via to via 6mil, smd to smd 6mil, copper to edge 6mil, drill to drill 6mil, minimum pad ring 12mil, minimum via ring 8mil, stop-mask expansion 4mil, vias tented up to drill 20mil, thermal gap 8mil

### Footprints (pad centres in the part's own frame; a part is rotated, then mirrored left to right if it is on the bottom)
0603-CAP = smd 1.1 x 1: 1 -0.85,0; 2 0.85,0
LED-0603 = smd 1 x 1: A 0,-0.877; C 0,0.877
SMA-DIODE = smd 1.27 x 1.47: A -2.15,0; C 2.15,0
3,0 = hole 3: 0,0
1X01 = drill 1.016 pad 1.88: 1 0,0
1X05 = drill 1.016 pad 1.88: 1 0,0; 2 2.54,0; 3 5.08,0; 4 7.62,0; 5 10.16,0
MICROSD = smd 0.7 x 1.5: 1 9,-10.64; 2 7.9,-10.24; 3 6.8,-10.64; 4 5.7,-11.04; 5 4.6,-10.64; 6 3.5,-11.04; 7 2.4,-10.64; 8 1.3,-10.64 | smd 1.8 x 1.4: CD1 2,-0.44; CD2 8,-0.44 | smd 1.4 x 1.9: MT1 0.4,-13.54; MT2 13.6,-14.44
2X3 = drill 1.016 pad 1.88 octagon: 1 0,0; 2 0,2.54; 3 2.54,0; 4 2.54,2.54; 5 5.08,0; 6 5.08,2.54
FPC-0.3-39 = smd 0.3 x 0.8: 1 -1.2,-1.35; 3 -0.6,-1.35; 5 0,-1.35; 7 0.6,-1.35; 9 1.2,-1.35; 11 1.8,-1.35; 13 2.4,-1.35; 15 3,-1.35; 17 3.6,-1.35; 19 4.2,-1.35; 21 4.8,-1.35; 23 5.4,-1.35; 25 6,-1.35; 27 6.6,-1.35; 29 7.2,-1.35; 31 7.8,-1.35; 33 8.4,-1.35; 35 9,-1.35; 37 9.6,-1.35; 39 10.2,-1.35 | smd 0.3 x 0.65: 2 -0.89,1.525; 4 -0.29,1.525; 6 0.31,1.525; 8 0.91,1.525; 10 1.51,1.525; 12 2.11,1.525; 14 2.71,1.525; 16 3.31,1.525; 18 3.91,1.525; 20 4.51,1.525; 22 5.11,1.525; 24 5.71,1.525; 26 6.31,1.525; 28 6.91,1.525; 30 7.51,1.525; 32 8.11,1.525; 34 8.71,1.525; 36 9.31,1.525; 38 9.91,1.525 | smd 0.4 x 0.895: H1 -1.9,-1.15; H2 10.9,-1.15
JST-2-SMD = smd 1 x 4.6: 1 -1,-3.7; 2 1,-3.7 | smd 1.6 x 3.4: NC1 -3.4,1.5; NC2 3.4,1.5
BATTCOM_20MM_PTH = drill 1.3: 1 11.85,0; 2 -8.15,0
1X02 = drill 1.016 pad 1.88: 1 0,0; 2 2.54,0
USB-MICROB-SLOT-HOLE = smd 0.4 x 1.35: D+ 0,2.675; D- -0.65,2.675; GND 1.3,2.675; ID 0.65,2.675; VBUS -1.3,2.675 | drill 0.5 pad 1.1 long: MT1 -2.775,0; MT2 2.775,0 | smd 1.5 x 1.9: P$1 -1,0; P$2 1,0.01 | hole 0.6: -1.95,2.1; 1.95,2.1
INDUCTOR-NR3015 = smd 0.8 x 2.7: 1 -1.1,0; 2 1.1,0
4040(1515) = smd 1.5 x 3.5: P$1 1.25,0; P$2 -1.25,0
SOT23-3 = smd 0.8 x 0.9: 1 -0.95,-1; 2 0.95,-1; 3 0,1.1
0603-RES = smd 1.1 x 1: 1 -0.85,0; 2 0.85,0
TC33X = smd 1.2 x 1.2: 1 -1,-1.825; 3 1,-1.825 | smd 1.5 x 1.6: 2 0,1.5
1206 = smd 1.6 x 1.8: 1 -1.4,0; 2 1.4,0
SJ_2 = smd 1.168 x 1.6: 1 -1.524,0; 2 0,0; 3 1.524,0
TACTILE-PTH = drill 1.016 pad 1.88: 1 -3.251,2.261; 2 3.251,2.261; 3 -3.251,-2.261; 4 3.251,-2.261
TP35_BOT = smd 0.889 x 0.889 bottom: P$1 0,0
SOT23-5 = smd 0.55 x 1.2: 1 -0.95,-1.3; 2 0,-1.3; 3 0.95,-1.3; 4 0.95,1.3; 5 -0.95,1.3
QFN-16 = smd 0.8 x 0.4: 1 -2.35,1.2; 2 -2.35,0.4; 3 -2.35,-0.4; 4 -2.35,-1.2; 9 2.35,-1.2; 10 2.35,-0.4; 11 2.35,0.4; 12 2.35,1.2 | smd 0.35 x 0.8: 5 -1.2,-2.35 | smd 0.4 x 0.8: 6 -0.4,-2.35; 7 0.4,-2.35; 8 1.2,-2.35; 13 1.2,2.35; 14 0.4,2.35; 15 -0.4,2.35; 16 -1.2,2.35 | smd 3.19 x 3.19: EXP 0,0
QFN-20(4X4) = smd 0.8 x 0.25: 1 -2.05,1.1; 2 -2.05,0.6; 3 -2.05,0.1; 4 -2.05,-0.4; 5 -2.05,-0.9; 11 2.05,-0.9; 12 2.05,-0.4; 13 2.05,0.1; 14 2.05,0.6; 15 2.05,1.1 | smd 0.25 x 0.8: 6 -1,-2.05; 7 -0.5,-2.05; 8 0,-2.05; 9 0.5,-2.05; 10 1,-2.05; 16 1,2.05; 17 0.5,2.05; 18 0,2.05; 19 -0.5,2.05; 20 -1,2.05 | smd 2.7 x 2.7: EXP 0,0
LGA14 = smd 0.5 x 1.2: 1 2,1.1; 2 1.2,1.1; 3 0.4,1.1; 4 -0.4,1.1; 5 -1.2,1.1; 6 -2,1.1; 8 -2,-1.1; 9 -1.2,-1.1; 10 -0.4,-1.1; 11 0.4,-1.1; 12 1.2,-1.1; 13 2,-1.1 | smd 1.2 x 0.5: 7 -2.1,0; 14 2.1,0
MSOP-10 = smd 0.305 x 0.889: 1 -1,-2.11; 2 -0.5,-2.11; 3 0,-2.11; 4 0.5,-2.11; 5 1,-2.11; 6 1,2.11; 7 0.5,2.11; 8 0,2.11; 9 -0.5,2.11; 10 -1,2.11
PHOTON_STACKABLE = drill 1.016 pad 1.88: 1 1.27,32.258; 2 1.27,29.718; 3 1.27,27.178; 4 1.27,24.638; 5 1.27,22.098; 6 1.27,19.558; 7 1.27,17.018; 8 1.27,14.478; 9 1.27,11.938; 10 1.27,9.398; 11 1.27,6.858; 12 1.27,4.318; 13 19.05,4.318; 14 19.05,6.858; 15 19.05,9.398; 16 19.05,11.938; 17 19.05,14.478; 18 19.05,17.018; 19 19.05,19.558; 20 19.05,22.098; 21 19.05,24.638; 22 19.05,27.178; 23 19.05,29.718; 24 19.05,32.258; #1 3.81,32.258; #2 3.81,29.718; #3 3.81,27.178; #4 3.81,24.638; #5 3.81,22.098; #6 3.81,19.558; #7 3.81,17.018; #8 3.81,14.478; #9 3.81,11.938; #10 3.81,9.398; #11 3.81,6.858; #12 3.81,4.318; #13 21.59,4.318; #14 21.59,6.858; #15 21.59,9.398; #16 21.59,11.938; #17 21.59,14.478; #18 21.59,17.018; #19 21.59,19.558; #20 21.59,22.098; #21 21.59,24.638; #22 21.59,27.178; #23 21.59,29.718; #24 21.59,32.258; @1 -1.27,32.258; @2 -1.27,29.718; @3 -1.27,27.178; @4 -1.27,24.638; @5 -1.27,22.098; @6 -1.27,19.558; @7 -1.27,17.018; @8 -1.27,14.478; @9 -1.27,11.938; @10 -1.27,9.398; @11 -1.27,6.858; @12 -1.27,4.318; @13 16.51,4.318; @14 16.51,6.858; @15 16.51,9.398; @16 16.51,11.938; @17 16.51,14.478; @18 16.51,17.018; @19 16.51,19.558; @20 16.51,22.098; @21 16.51,24.638; @22 16.51,27.178; @23 16.51,29.718; @24 16.51,32.258
SO08 = smd 0.61 x 2.21: 1 -1.905,-2.616; 2 -0.635,-2.616; 3 0.635,-2.616; 4 1.905,-2.616; 5 1.905,2.616; 6 0.635,2.616; 7 -0.635,2.616; 8 -1.905,2.616
MSOP-8 = smd 0.41 x 1.02: 1 -0.975,-2.4; 2 -0.325,-2.4; 3 0.325,-2.4; 4 0.975,-2.4; 5 0.975,2.4; 6 0.325,2.4; 7 -0.325,2.4; 8 -0.975,2.4
TP60_BOT = smd 1.524 x 1.524 bottom: P$1 0,0

### Placement (x,y rotation side)
C01B  4.95,35.43 0 top
C01M  73.79,53.09 270 top
C01S  6.86,69.22 0 top
C02B  8.51,28.07 90 top
C02M  61.09,52.96 270 top
C02S  62.1,74.55 0 top
C03B  12.06,38.73 180 top
C03S  62.1,72.01 0 top
C04B  11.3,53.59 270 top
C04S  62.1,77.09 0 top
C05B  18.29,47.62 0 top
C06B  18.29,45.09 0 top
C07B  29.21,39.37 180 top
C08B  30.99,35.05 180 top
C09B  34.42,43.94 180 top
C10B  36.07,35.05 0 top
C11B  26.67,24.38 270 top
C12B  26.67,19.81 270 top
C13B  35.56,23.88 90 top
C14B  35.56,19.81 270 top
C15B  31.27,11.43 0 top
C16B  31.24,4.57 180 top
C17B  35.81,10.41 270 top
C19B  3.05,50.29 0 top
C20B  5.33,56.9 180 top
D01B  16.51,32.89 90 top
D01S  19.56,75.31 270 top
D02B  16.51,37.21 90 top
D03B  25.65,45.72 90 top
D04B  25.65,39.12 90 top
D05B  40.64,39.12 270 top
D06B  2.03,56.64 0 top
H1  6.5,6.5 0 top
H2  73.5,26.5 0 top
H3  73.5,93.5 0 top
H4  6.5,93.5 0 top
J01B  5.97,46.1 0 top
J01M  20.83,84.33 90 top
J01S  16.38,84.84 270 top
J02B  8.64,56.26 0 top
J02M  59.82,90.42 90 top
J02S  53.34,8.64 0 top
J03B  3.68,19.18 90 top
J03M  65.53,78.49 90 bottom
J04B  12.95,20.57 90 top
J05B  16.76,23.11 0 top
J06B  13.21,46.23 0 top
J07B  1.78,40.64 270 top
J08B  30.35,54.61 270 top
J09B  26.16,30.99 270 top
J10B  43.05,30.99 270 top
J11B  26.92,15.24 270 top
J12B  35.69,15.24 270 top
J13B  39.37,10.41 0 top
L01B  19.81,51.31 270 top
L02B  29.72,48.13 0 top
L03B  37.34,48.13 180 top
LOGO1  17.02,6.1 0 top
Q01B  34.67,54.61 90 top
R01B  18.41,34.92 180 top
R01D  50.67,13.34 0 top
R01M  66.04,60.33 90 top
R01S  19.56,77.34 0 top
R02B  18.29,39.24 0 top
R02D  49.02,4.06 180 top
R02M  68.33,60.58 90 top
R02S  57.78,78.99 180 top
R03B  16.51,30.73 0 top
R03D  50.67,15.88 0 top
R03M  70.61,60.58 90 top
R04B  16.51,28.32 0 top
R04D  59.69,14.73 270 top
R04M  55.24,59.05 180 top
R05B  12.83,28.07 90 top
R05D  62.23,14.73 270 top
R05M  60.07,60.83 0 top
R06B  2.67,32.89 0 top
R06D  67.94,4.45 180 top
R06M  60.07,58.29 0 top
R07B  2.67,30.35 0 top
R07D  67.31,14.73 90 top
R08B  8.51,38.48 270 top
R08D  67.94,9.02 180 top
R08M  40.26,72.9 0 top
R09B  2.67,27.81 0 top
R09D  67.94,11.3 180 top
R09M  40.26,70.36 0 top
R10B  6.1,28.07 90 top
R10D  67.94,6.73 180 top
R11B  14.48,54.74 180 top
R11D  64.77,14.73 270 top
R12B  37.72,54.61 90 top
R13B  30.99,32.26 180 top
R14B  30.99,29.46 0 top
R15B  36.07,32.26 0 top
R16B  36.07,29.46 180 top
R17B  26.67,6.1 90 top
R18B  36.83,5.08 0 top
R19B  16.51,41.91 0 top
R20B  2.03,53.09 90 top
R21B  6.1,49.78 90 top
R22B  4.19,62.87 0 top
SJ1  72.52,3.05 270 top
SW01M  12.45,61.98 180 top
TP01B  16.76,54.74 0 bottom
U1  5.08,53.59 180 top
U01B  10.29,33.53 90 top
U01M  69.6,54.36 270 top
U01S  58.04,74.55 270 top
U02B  14.86,51.44 90 top
U02M  56.9,54.36 270 top
U03B  33.53,39.37 0 top
U03M  28.19,63.37 0 top
U04B  30.73,22.1 0 top
U05B  39.62,22.1 0 top
U06B  31.24,8.13 270 top
U$1  66.29,57.66 0 bottom
U$2  66.29,56.13 0 bottom
U$3  53.59,57.4 0 bottom
U$4  53.09,55.12 0 bottom
U$5  14.99,88.14 0 bottom

### Tracks (layer width: path | path; a pad name or v marks a point on that pad's centre or on a via)
1
  Top 0.254: U01B.9 12,35.88 13.21,37.08 15.51,37.08 D02B.C 15.63,41.88 R19B.1
+3V3  (via drill 0.3 pad 0.61, 0.5 pad 0.61, 0.5 pad 1.27)  (3 unrouted)
  Top 0: 57.15,95.5 J02M.6
  Top 0.254: 61.49,53.85 61.13,53.85 C02M.1 60.54,54.36 U02M.18 60.53,54.36 60.83,54.05 61.16,54.05 61.39,53.82 | 61.39,53.82 61.54,53.82 | 61.39,53.82 61.37,53.82 61.32,53.87 61.47,53.87 61.49,53.85 | 61.49,53.85 v62.87,53.85 | U01M.18 73.37,54.36 C01M.1 73.91,54.06 v73.91,55.37
  Top 0.305: U03M.#24 57.02,95.63 57.15,95.5 | 43.69,95.76 42.16,95.76 39.41,93 R08M.1 R09M.1 39.37,70.32 v39.37,64.77 | 43.69,95.76 44.58,95.76 U03M.@24 43.81,95.63 43.69,95.76 | v6.1,66.29 6.1,69.13 C01S.1
  Top 0.406: J01S.4 4.97,79.14 4.83,78.99 4.32,78.99 4.06,78.74 4.06,71.16 C01S.1
  Top 0.61: L01B.2 19.81,50.04 19.05,49.28 | 19.05,49.28 13.34,49.28 | C06B.2 C05B.2 19.14,49.19 19.05,49.28 | 13.34,50.26 13.34,49.28 | 13.34,49.28 13.34,46.35 J06B.1
  Top 1.676: U03M.@24 U03M.#24 49.78,95.5
  Bottom 0.254: v39.37,64.77 58.42,64.77 62.74,60.45 62.74,54.1 62.84,54 62.84,53.85 v62.87,53.85 63.12,54.1 73.91,54.1 v73.91,55.37
  Bottom 0.406: J01M.3 20.07,89.41
  Bottom 0.61: SW01M.1 13.61,59.72 13.34,59.44
  Bottom 0.813: U03M.24 38.99,95.63 36.58,98.04 18.8,98.04 12.77,92.02 arc45 12.7,91.84 12.7,89.41 | 13.34,46.23 13.34,59.44 13.34,64.79 arc45 13.26,64.97 12.7,65.53 12.7,66.29 | 12.7,66.29 12.7,89.41 | 12.7,66.29 v6.1,66.29 | 20.07,89.41 12.7,89.41
+15V
  Top 0.254: J02S.2 43.69,10.16 38.61,15.24 J12B.1
  Top 0.406: U06B.8 33.64,11.06 33.27,11.43 | 33.27,11.43 C15B.2 | 33.27,11.43 33.27,12.83 J12B.1
  Top 0.61: U05B.1 37.72,19.18 37.59,19.05 35.65,19.05 C14B.2 35.69,18.96 J12B.1
+22V  (via drill 0.3 pad 0.61)
  Top 0.254: J02S.23 58.74,8.19 58.42,8.51 43.56,8.51 v43.05,8.13
  Top 0.406: R15B.2 C10B.2
  Top 0.61: D05B.C 40.64,35.05 | 40.64,35.05 40.64,30.99 | C10B.2 40.64,35.05 | J10B.1 40.64,30.99 | 40.64,30.99 40.64,29.72 37.72,26.8 U05B.8 37.71,24.73 C13B.2
  Bottom 0.305: v43.05,8.13 J10B.1
-15V  (via drill 0.3 pad 0.61)
  Top 0.254: J02S.1 52.15,6.25 51.46,6.25 v51.05,5.84
  Top 0.305: 28.7,18.8 28.7,19.36 U04B.1
  Top 0.406: C16B.2 29.21,4.57 28.87,4.91 28.87,6.9 28.84,6.92 U06B.4 26.88,7.15 R17B.2 26.67,8.38 26.92,8.64 J11B.1
  Top 0.61: 28.7,18.8 26.67,18.8 C12B.2 26.92,18.96 J11B.1
  Bottom 0.254: v51.05,5.84 36.32,5.84 J11B.1
-20V  (via drill 0.3 pad 0.61)
  Top 0.254: J02S.24 59.05,11.43 v59.69,12.06 | v24.26,22.86 26,22.86 C11B.2
  Top 0.305: U04B.3 U04B.2 30.1,21.97 29.72,22.35
  Top 0.406: R13B.2 C08B.2 | C11B.2 26.67,22.86 27.18,22.35 29.72,22.35 29.97,22.35 30.23,22.61 30.23,24.59 U04B.7
  Top 0.61: C08B.2 30.14,36.16 29.46,36.83 25.79,36.83 D04B.A | U04B.6 U04B.7 30.1,26.29 28.45,27.94 28.45,30.99 | R13B.2 28.7,32.26 28.45,32 28.45,30.99 | J09B.1 28.45,30.99
  Bottom 0.254: v59.69,12.06 59.69,9.91 58.67,8.89 58.67,6.1 59.05,5.71 59.05,3.17 58.29,2.41 36.96,2.41 24,15.37 24,22.61 v24.26,22.86
BAT+  (via drill 1.02 pad 1.93)  (1 unrouted)
  Top 0.406: U1.3 4.06,54.89 4.06,55.75 4.45,56.13 4.45,56.86 C20B.2
  Top 1.016: J03B.2 12.56,20.18 J04B.1 | R22B.1 2.92,62.73 v2.92,59.69 4.48,58.13 C20B.2
  Bottom 0.406: 4.32,58.67 4.19,58.67
  Bottom 1.016: J04B.1 12.56,20.18 J03B.2 5.84,21.72 5.84,41.66 8.89,44.7 8.89,48.77 7.62,50.04 4.57,50.04 4.32,50.29 4.32,58.29 v2.92,59.69
  pour Top (no thermals): 13.21,21.34 5.33,21.34 5.33,21.08 5.33,19.81 13.72,19.81 13.72,21.34
BM_BAT
  Top 0.305: U01B.3 10.67,31.18 10.67,30.23 | 10.67,30.23 10.67,25.4 J04B.2 | 10.67,30.23 9.91,30.23 9.91,31.16 U01B.2
  Top 1.016: C02B.2 9.87,28.92 9.91,28.96 | J05B.1 J04B.2
  pour Top (no thermals): 10.92,31.5 10.92,25.4 17.53,25.4 17.53,22.35 9.78,22.35 9.78,31.5
BM_CE
  Top 0.254: U01B.4 12,31.18 12.45,30.73 12.45,29.3 R05B.2
BM_CHG  (via drill 0.3 pad 0.61)  (1 unrouted)
  Top 0.305: v19.05,41.91 R19B.2
  Top 1.676: U03M.#12 U03M.@12
  Bottom 0.305: v19.05,41.91 19.05,66.8 19.81,67.56 26.8,67.56 U03M.@12
BM_OUT  (1 unrouted)
  Top 0.254: 19.3,39.24 19.3,39.88 20.32,40.89 20.32,43.18 20.07,43.43 15.24,43.43 13.97,42.16 11.21,42.16
  Top 0.305: U01B.10 10.67,35.88 | 13.63,52.45 U02B.4 13.72,52.54 | 11.47,52.38 11.28,52.38 C04B.2 | R04B.2 17.23,28.45 18.41,28.45 19.27,29.43 R01B.1 19.3,34.96 19.3,39.24
  Top 0.406: 11.21,52.38 11.21,42.16 C03B.2
  Top 0.61: U02B.4 11.47,52.38 11.21,52.38 | R12B.2 35.77,55.46 Q01B.2
  Top 0.813: Q01B.2 34.34,56.9 13.72,56.9 13.72,54.83 R11B.2 13.72,54.65 | 13.72,56.39 13.72,54.65 | 13.72,52.54 13.72,54.65 | C04B.2 8.98,52.74 8.64,53.09 J02B.1 8.64,57.15 5.59,60.2 5.59,61.34 R22B.2
  pour Top (no thermals): 10.79,35.56 9.78,35.56 9.78,42.67 8.64,43.81 8.64,52.7 11.3,52.7 11.3,37.34 10.79,36.83
BM_PGOOD  (via drill 0.3 pad 0.61)  (1 unrouted)
  Top 0.305: 15.75,33.01 15.75,33.91 | 15.75,33.91 v15.75,34.67 | 15.75,33.01 D01B.C | U01B.7 15.73,33.93 15.75,33.91 | 15.75,33.01 15.75,33.91
  Top 1.676: U03M.#6 U03M.@6
  Bottom 0.305: v15.75,34.67 15.75,42.42 17.65,43.94 17.65,73.28 U03M.@6
BM_SYSOFF
  Top 0.305: U01B.15 5.7,33.13 3.56,30.99 3.56,30.39 R07B.2
CE2
  Top 0.254: J02S.10 54.85,12.56 55.5,13.34 55.5,14.99 54.61,15.75 54.36,16 51.65,16 R03D.2
CL  (via drill 0.3 pad 0.61)
  Top 0.254: U02M.9 53.73,53.86 53.34,53.47 v53.34,50.93 | J02S.5 53.34,5.84 v52.7,4.95
  Bottom 0.254: v52.7,4.95 53.34,5.84 v53.34,50.93
D0
  Top 0.254: J02S.12 55.45,12.27 56.13,12.95 56.13,48.26 56.39,48.51 56.77,48.9 57.4,49.53 61.72,49.53 66.05,53.86 U01M.9
D1  (via drill 0.3 pad 0.61)
  Top 0.254: U01M.10 66.82,53.36 v66.29,52.83 | J02S.13 55.74,4.58 v56.01,4.32
  Bottom 0.254: v56.01,4.32 55.75,4.57 55.75,10.29 56.52,11.05 56.52,48.77 57.78,50.04 63.5,50.04 v66.29,52.83
D2
  Top 0.254: J02S.14 56.05,11.85 56.77,12.57 56.77,47.75 57.78,48.77 64.01,48.77 67.56,52.32 68.68,52.32 U01M.11
D3  (via drill 0.3 pad 0.61)
  Top 0.254: J02S.15 56.34,5.38 v56.52,5.21 | v68.45,51.05 68.58,51.05 69.22,51.69 69.22,52.29 U01M.12
  Bottom 0.254: v56.52,5.21 56.39,5.33 56.39,9.91 57.28,10.79 57.28,48.26 58.17,49.15 66.55,49.15 v68.45,51.05
D4
  Top 0.254: 69.72,52.31 U01M.13 69.72,52.28 69.72,51.05 66.55,47.88 58.04,47.88 57.4,47.24 57.4,12.19 56.65,11.44 J02S.16
D5  (via drill 0.3 pad 0.61)
  Top 0.254: 70.23,52.31 U01M.14 70.23,52.27 v70.23,50.29 | J02S.17 56.94,5.92 57.4,5.46 v57.4,4.45
  Bottom 0.254: v57.4,4.45 57.4,5.46 57.02,5.84 57.02,9.53 58.04,10.54 58.04,47.75 58.55,48.26 68.2,48.26 v70.23,50.29
D6
  Top 0.254: 70.74,52.31 U01M.15 70.74,52.26 70.74,51.44 71.25,50.93 71.25,49.66 68.71,47.12 58.55,47.12 58.04,46.61 58.04,11.81 57.25,11.02 J02S.18
D7  (via drill 0.3 pad 0.61)
  Top 0.254: 71.75,53.36 U01M.16 71.75,53.25 71.75,51.82 72.26,51.31 v72.26,50.67 | J02S.19 57.54,6.09 58.29,5.33 58.29,3.81 v57.91,3.43
  Bottom 0.254: v57.91,3.43 58.29,3.81 58.29,5.33 57.66,5.97 57.66,9.02 58.8,10.16 58.8,46.99 59.18,47.37 68.96,47.37 v72.26,50.67
E_INK_VDD  (via drill 0.3 pad 0.61)  (1 unrouted)
  Top 0.254: J02S.4 53.05,11.09 52.32,11.81 48.77,11.81 v48.64,11.94 | R05D.1 62.23,16.89 63.25,17.91 67.31,17.91 68.96,16.26 68.96,11.47 R09D.1 R08D.1 69.47,9.02 71.25,7.24 71.25,6.48 71.5,6.22 73.28,6.22 73.66,5.84 73.66,1.78 73.41,1.52 SJ1.3 72.52,1.78 47.75,1.78 46.61,2.92 46.61,5.21 48.01,6.6 v48.64,6.6 | 49.7,13.21 R01D.1
  Top 0.406: U03M.#11 34.42,70.23 35.31,69.34 35.31,64.39 40.77,58.93 52.83,58.93 | R04M.2 54.27,58.93 52.83,58.93 | 52.83,58.93 51.82,57.91 51.82,49.53 55.12,46.23 55.12,18.54 54.61,18.03 49.02,18.03 48.51,17.53 48.51,13.21 | 48.51,13.21 48.51,12.06 v48.64,11.94 | 49.7,13.21 48.51,13.21
  Top 1.676: U03M.#11 U03M.@11
  Bottom 0.254: v48.64,11.94 v48.64,6.6
FB2
  Top 0.305: U03B.5 35.13,37.26 35.31,37.08 35.31,35.14 C10B.1
  Top 0.406: C10B.1 R15B.1 R16B.2
GMODE2  (via drill 0.3 pad 0.61)  (1 unrouted)
  Top 0.254: R04D.1 v59.69,16.89 | v59.94,4.57 J02S.27
  Top 1.676: U03M.#15 U03M.@15
  Bottom 0.254: v59.94,4.57 59.94,9.02 60.33,9.4 60.33,11.56 60.45,11.68 60.45,12.7 60.33,12.7 59.82,13.21 59.82,16.76 v59.69,16.89 59.69,45.59 60.58,46.48 71.88,46.48 75.44,50.04 75.44,68.07 70.61,72.9 49.91,72.9 U03M.#15
GND  (via drill 0.3, 0.5 pad 0.61, 0.5 pad 0.81)
  Top 0: C02M.2 60.92,52.11 60.71,52.32
  Top 0.254: U03B.7 34.03,42.41 34.29,42.67 35.05,42.67 35.05,43.73 | U01S.2 58.48,73.35 58.17,73.66 57.91,73.66 57.66,73.41 57,73.41 U01S.12 | U03B.3 33.53,35.05 | 59.69,53.85 58.95,53.85 U02M.17 | U01M.17 72.38,53.86 72.64,53.59 72.64,52.32 72.9,52.07 73.62,52.07 C01M.2
  Top 0.305: 35.05,43.73 C09B.1 | U03B.9 33.03,42.16 33.02,42.16 | 60.71,52.32 59.94,53.09 59.94,53.59 59.69,53.85
  Top 0.61: U05B.3 U05B.2 | U05B.7 U05B.6
  other vias: 64.77,55.88 70.61,4.32 66.8,17.02 14.22,40.13 14.22,35.56 35.81,13.21 55.12,77.72 10.67,18.29 10.67,17.02 10.67,15.75 8.38,41.4 7.37,52.32 9.32,34.54 10.29,34.54 11.25,34.54 11.25,33.53 9.32,33.53 10.29,33.53 9.32,32.51 10.29,32.51 11.25,32.51
  pour Top (isolate 0.127, rank 2): -1.78,102.11 102.36,102.11 102.36,-2.79 -1.78,-2.79
  pour Bottom (isolate 0.305, rank 2): -1.27,105.41 105.41,105.41 105.41,-3.81 -5.08,-3.81 -5.08,105.41
JTAG_TCK  (1 unrouted)
  Top 0.305: J02M.3 61.47,92.96 61.98,92.46 61.98,85.09 59.69,82.8 49.91,82.8 U03M.#19
  Top 1.676: U03M.#19 U03M.@19
JTAG_TMS  (1 unrouted)
  Top 0.305: J02M.1 59.82,85.98 59.44,85.6 49.91,85.6 U03M.#20
  Top 1.676: U03M.#20 U03M.@20
JTAG_TRST  (1 unrouted)
  Top 0.254: R02S.1 58.67,78.99 58.67,81.28
  Top 0.305: J02M.5 62.74,95.5 63.25,95 63.25,84.58 59.94,81.28 58.67,81.28 55.37,81.28 52.32,78.23 52.32,76.45 51.31,75.44 49.91,75.44 U03M.#16
  Top 1.676: U03M.#16 U03M.@16
LE  (via drill 0.3 pad 0.61)
  Top 0.254: J02S.6 53.65,13.52 v54.1,14.1 | v54.61,51.05 54.61,53.12 U02M.10
  Bottom 0.254: v54.1,14.1 54.1,50.55 v54.61,51.05
MCU_RST  (1 unrouted)
  Top 0.305: J02M.4 49.91,92.96 U03M.#23
  Top 1.676: U03M.#23 U03M.@23
MCU_RX  (1 unrouted)
  Top 0.406: U03M.@4 25.53,88.01 23.62,89.92 23.62,91.69 23.37,91.95 J01M.4
  Top 1.676: U03M.#4 U03M.@4
MCU_TX  (1 unrouted)
  Top 0.406: U03M.@3 25.27,90.55 24.64,91.19 24.64,93.47 23.62,94.49 J01M.5
  Top 1.676: U03M.#3 U03M.@3
MCU_VBAT  (2 unrouted)
  Top 1.676: U03M.#22 U03M.@22
  Bottom 0.406: J03M.1 65.53,90.17 63.25,87.88 54.61,87.88 52.07,90.42 46.86,90.42
MCU_VIN  (1 unrouted)
  Top 1.676: U03M.#1 U03M.@1
MCU_WKP  (1 unrouted)
  Top 1.676: U03M.#5 U03M.@5
  Bottom 0.406: SW01M.3 15.7,74.88 24.64,83.82 24.64,84.84 25.4,85.6 26.8,85.6 U03M.@5
N$1
  Top 0.254: R04D.2 59.82,13.76 59.82,13.21 60.33,12.7 60.45,12.7 60.45,11.68 60.25,11.48 J02S.28
N$2
  Top 0.254: 32.4,41.66 32.4,41.61 U03B.10
  Top 0.406: 32.4,41.66 30.23,41.66 | 30.23,41.66 28.45,41.66 28.45,47.37 L02B.P$2 | 30.23,41.66 30.06,41.57 C07B.1
N$3
  Top 0.61: C07B.2 27.18,39.37 26.92,39.62 26.92,41.15 26.81,41.27 D04B.C D03B.A
N$4
  Top 0.254: U01B.12 9.14,35.88 9.14,36.58 8.64,37.08 8.64,37.5 R08B.2
N$5
  Top 0.254: J02S.31 61.14,5.79 62.48,4.45 R06D.2
N$6
  Top 0.406: U06B.5 36.26,7.15 R18B.2
N$7
  Top 0.406: R18B.3 37.83,2.52 37.08,1.78 28.19,1.78 26.67,3.81 R17B.1
N$8
  Top 0.305: U03B.6 34.53,41.53 34.66,41.66
  Top 0.406: 38.86,41.66 34.66,41.66 | 38.86,41.66 40.25,41.66 D05B.A | 38.86,41.66 38.86,47.86 L03B.P$2
N$9
  Top 0.305: U01B.16 6.17,32.33 5.33,31.5 5.33,30.48 4.83,29.97 4.83,29.46 3.81,28.45 3.81,28.11 R09B.2 3.56,27.85
N$10
  Top 0.254: R02S.2 U01S.8
N$11
  Top 0.305: R04B.1 14.61,28.32 14.35,28.57 14.35,29.59 13.84,30.1 13.84,30.48 12.83,31.5 12.83,32.14 U01B.5
N$12
  Top 0.305: U01B.6 13.35,33.13 13.84,32.64 13.84,31.75 14.61,30.99 15.15,30.99 R03B.1
N$13
  Top 0.305: U01B.14 5.23,33.93 4.06,32.77 3.9,32.77 R06B.2
N$14  (1 unrouted)
  Top 0.254: U01M.4 69.2,57.04 68.33,57.91 66.8,57.91 66.55,57.66
N$15
  Top 0.254: U01B.1 6.54,31.18 6.1,30.73 R10B.2
N$16
  Top 0.254: U01M.7 66.81,54.86 66.8,54.86 66.55,54.86 66.29,55.12 U$2.P$1
N$17
  Top 0.305: D02B.A 17.39,39.19 R02B.1
N$18
  Top 0.305: D01B.A 17.39,34.75 R01B.2
N$19
  Top 0.406: U1.5 6.03,50.7 R21B.2
N$20
  Top 0.254: U02M.4 56.5,57.3 56.39,57.4 U$3.P$1
N$21
  Top 0.254: U02B.1 15.05,50.48 14.99,50.55 14.99,53.34 15.49,53.85 15.49,54.9 R11B.1
  Top 0.305: TP01B.P$1 R11B.1
N$22
  Top 0.254: U02M.7 53.35,54.86 U$4.P$1
N$23
  Top 0.305: 16.18,52.41 U02B.3
  Top 0.61: 16.18,52.41 16.18,53.01 16.76,53.59 18.63,53.59 L01B.1
N$24
  Top 0.254: U01M.1 70.7,59.65 R03M.1
N$25
  Top 0.254: U01M.3 69.7,57.3 68.58,58.42 67.09,58.42 R01M.1
N$26
  Top 0.254: J02S.35 62.34,6.49 62.87,5.97 65.28,5.97 65.28,6.6 66.29,7.62 66.29,8.76 66.42,8.89 66.97,8.89 R08D.2
N$27
  Top 0.254: J02S.36 62.65,10.58 63.12,11.05 63.25,11.05 63.63,11.43 66.97,11.43 R09D.2
N$28
  Top 0.254: J02S.9 54.54,4.76 54.1,4.32 54.1,3.3 50.55,3.3 R02D.1
N$29
  Top 0.254: R07D.1 67.22,13.88 65.53,12.19 62.74,12.19 62.61,12.06 62.61,11.3 62.05,10.74 J02S.34
N$30
  Top 0.254: U1.1 6.1,54.89 6.1,53.85 5.84,53.59 3.81,53.59 3.3,54.1 3.3,57.4 3.05,57.66 2.17,57.66 D06B.C
  Top 0.406: 6.1,54.83 U1.1
N$32
  Top 0.254: U02M.1 58,57.74 58.42,58.17 59.09,58.17 R06M.1
N$33
  Top 0.254: U02M.2 57.5,60.8 57.66,60.96 59.09,60.96 R05M.1
N$34
  Top 0.254: U02M.3 57,58.83 56.9,58.93 56.22,58.93 R04M.1
N$35
  Top 0.254: U01M.2 70.2,57.82 69.09,58.93 68.83,58.93 68.58,59.18 68.58,59.48 R02M.1
N$36
  Top 0.305: U01S.7 58.14,76.55 U01S.6 59.68,77.09 C04S.1 C02S.1 C03S.1 59.68,72.01 U01S.1
N$37
  Top 0.254: D06B.A R20B.2
NEG_EN  (via drill 0.3 pad 0.61, 0.5 pad 0.61)
  Top 0.254: U03B.2 33.03,38.87 34.04,39.88 36.32,39.88 v36.58,40.13 | U02M.13 57,51.46 57.15,51.31 v57.66,51.31
  Bottom 0.254: v57.66,51.31 57.66,52.45 57.28,52.83 52.07,52.83 51.31,52.07 51.31,40.64 50.8,40.13 v36.58,40.13
NFB1
  Top 0.305: U03B.1 32.43,37.26 31.75,36.58 31.75,35.39 C08B.1 R13B.1 R14B.2
OE  (via drill 0.3 pad 0.61)
  Top 0.254: U02M.11 56,51.3 v55.75,51.05 | J02S.7 53.94,5.17 v53.09,4.06
  Bottom 0.254: v53.09,4.06 53.98,5.21 53.98,10.67 54.99,11.68 54.99,50.29 v55.75,51.05
POS_EN  (via drill 0.3 pad 0.61, 0.5 pad 0.61)
  Top 0.254: U03B.4 34.03,38.35 34.8,39.12 36.32,39.12 v36.58,38.86 | v59.69,51.05 59.69,51.94 59.31,52.32 59.31,52.99 U02M.16
  Bottom 0.254: v36.58,38.86 51.56,38.86 52.07,39.37 52.07,51.56 52.58,52.07 56.13,52.07 56.64,51.56 56.64,50.67 56.77,50.55 59.18,50.55 v59.69,51.05
R01S
  Top 0.305: D01S.A 18.68,77.32 R01S.1
RL
  Top 0.254: J02S.29 60.54,5.25 62.74,3.05 SJ1.2
SCL  (via drill 0.5 pad 0.61)  (2 unrouted)
  Top 0.254: U02M.19 60.2,54.86 60.71,55.37 62.48,55.37 63.25,56.13 63.25,66.04 v63.5,66.29 | 49.91,70.1 51.82,70.1 53.34,68.58 58.17,68.58 | U01S.14 58.04,68.71 58.17,68.58 | 58.17,68.58 v63.5,68.58 71.88,68.58 72.9,67.56 72.9,55.37 72.38,54.86 U01M.19 | U03M.@14 43.81,70.23 42.8,71.25 42.8,72.26 42.29,72.77 41.24,72.77 R08M.2
  Top 1.676: U03M.#14 U03M.@14
  Bottom 0.254: v63.5,66.29 v63.5,68.58
SD_CD
  Top 0.254: J01S.CD1 15.94,87.18 U$5.P$1
SDA  (via drill 0.5 pad 0.61)  (1 unrouted)
  Top 0.254: 71.74,55.36 U01M.20 71.5,55.5 71.5,56.26 72.14,56.9 72.14,66.04 70.61,67.56 62.23,67.56 | U02M.20 | 59.17,55.36 59.17,56.12 59.44,56.39 61.72,56.39 62.23,56.9 62.23,67.56 | U01S.13 56.94,71.16 v56.9,71.12 | 62.23,67.56 49.91,67.56 U03M.#13 | U03M.@13 43.31,67.69 43.05,67.94 43.05,69.47 42.16,70.36 R09M.2
  Top 1.676: U03M.@13 U03M.13 U03M.#13
  Bottom 0.254: v56.9,71.12 56.9,68.07 56.39,67.56 49.78,67.56 U03M.#13
SHR
  Top 0.254: J02S.8 54.25,10.39 54.23,10.41 54.23,12.95 54.86,13.72 54.86,14.61 54.48,14.99 53.59,14.99 52.83,14.22 52.83,13.84 52.45,13.46 51.65,13.46 | 51.65,13.46 R01D.2 | 51.65,13.46 51.65,14.39 51.56,14.48 50.29,14.48 49.78,14.99 49.78,15.84
  Top 1.016: 49.78,15.84 R03D.1
SMPS_CTRL  (via drill 0.3 pad 0.61, 0.5 pad 0.61)
  Top 0.254: v39.75,53.85 37.81,53.85 R12B.1 | v58.67,51.69 58.42,51.69 58.29,51.82 58.29,52.01 U02M.15
  Top 0.61: R12B.1 37.63,53.76 37.59,53.72 35.73,53.72 Q01B.1
  Bottom 0.254: v58.67,51.69 58.67,52.96 58.04,53.59 40.01,53.59 v39.75,53.85
SPH  (via drill 0.3 pad 0.61)
  Top 0.254: U02M.12 56.52,52.31 56.52,50.04 55.88,49.4 v55.75,49.4 | J02S.11 55.14,4.09 v54.99,3.94
  Bottom 0.254: v54.99,3.94 55.12,4.06 55.12,10.79 55.75,11.43 v55.75,49.4
SPI_CS  (1 unrouted)
  Top 0.254: 20.57,75.31 23.5,75.31 24.64,74.17 24.64,72.9 24.89,72.64
  Top 0.406: D01S.C 20.57,75.31 | J01S.2 9.42,76.94 14.22,72.14 24.38,72.14 24.89,72.64 26.8,72.64 U03M.@10
  Top 1.676: U03M.#10 U03M.@10
SPI_MISO  (1 unrouted)
  Top 0.406: J01S.7 13.32,82.44 14.99,80.77 21.59,80.77 24.51,77.85 U03M.@8
  Top 1.676: U03M.#8 U03M.@8
SPI_MOSI  (via drill 0.5 pad 1.27)  (1 unrouted)
  Top 0.406: J01S.3 11.12,78.04 15.75,73.41 22.1,73.41 v22.61,73.91
  Top 1.676: U03M.#7 U03M.@7
  Bottom 0.305: v22.61,73.91 22.61,76.07 U03M.@7
SPI_SCK  (1 unrouted)
  Top 0.305: R01S.2 20.41,79.34 20.57,79.5
  Top 0.406: J01S.5 12.98,80.24 13.72,79.5 20.57,79.5 20.83,79.5 25.15,75.18 26.8,75.18 U03M.@9
  Top 1.676: U03M.#9 U03M.@9
U1CE2
  Top 0.254: J02S.30 60.85,11.32 61.09,11.56 61.09,13.59 61.47,13.97 62.14,13.97 R05D.2
U1CKV  (via drill 0.3 pad 0.61)  (1 unrouted)
  Top 0.254: R10D.2 66.84,6.48 66.29,6.48 66.04,6.22 v66.04,5.33 65.91,5.21 62.61,5.21 61.74,6.08 J02S.33
  Top 1.676: U03M.#18 U03M.@18
  Bottom 0.254: v66.04,5.33 69.72,5.33 70.99,6.6 70.99,7.49 65.91,12.57 65.91,17.78 65.79,17.91 62.1,17.91 61.47,18.54 61.47,43.69 62.23,44.45 73.15,44.45 76.96,48.26 76.96,69.34 70.61,75.69 55.12,75.69 50.55,80.26 49.91,80.26 U03M.#18
U1SPV  (via drill 0.3 pad 0.61)  (1 unrouted)
  Top 0.254: J02S.32 61.45,11.03 61.85,11.43 61.85,12.57 61.98,12.7 64.39,12.7 64.77,13.08 R11D.2 63.59,13.88 63.5,13.97 v63.5,16.76
  Top 1.676: U03M.#17 U03M.@17
  Bottom 0.254: U03M.#17 49.91,77.72 51.31,77.72 54.36,74.68 70.1,74.68 76.2,68.58 76.2,49.28 72.39,45.47 61.21,45.47 60.58,44.83 60.58,17.27 61.09,16.76 v63.5,16.76
U2CKV  (via drill 0.3 pad 0.61)
  Top 0.254: J02S.38 65.41,10.16 v65.53,10.29 | v70.1,7.11 69.85,6.73 R10D.1
  Bottom 0.254: v65.53,10.29 65.91,10.29 66.67,9.53 66.67,6.99 66.93,6.73 69.85,6.73 v70.1,7.11
U2SPV  (via drill 0.3 pad 0.61)
  Top 0.254: J02S.37 62.94,8.2 63.63,8.89 65.28,8.89 v65.53,9.14 | v64.77,17.02 R11D.1
  Bottom 0.254: v65.53,9.14 65.28,8.89 64.39,8.89 64.39,16.64 v64.77,17.02
VBUS
  Top 0.254: R20B.1 4.07,52.24 U1.4 | 4.06,52.23 4.06,50.46 C19B.2
  Top 0.305: U01B.13 7.18,34.73 6.6,35.31 5.93,35.31 C01B.2 6.35,35.98 6.35,41.4 5.81,41.94 J07B.VBUS
  Top 0.406: 5.81,41.94 5.81,45.94 J01B.1
  Top 0.813: J01B.1 4.7,46.1 4.06,46.74 4.06,52.23 U1.4
  pour Top (isolate 0.254, no thermals): 7.11,34.67 7.11,46.99 4.83,46.99 4.83,41.91 6.35,41.91 6.35,38.1 5.46,38.1 5.46,34.67
VCOM
  Top 0.254: J02S.22 58.45,9.55 58.17,9.27 40.51,9.27 J13B.1 38.52,9.56 C17B.2
  Top 0.406: C17B.2 35.81,8.89 35.38,8.45 U06B.7 U06B.6
VIN  (1 unrouted)
  Top 0.254: U03B.8 33.53,43.4 C09B.2
  Top 0.305: 33.57,48.26 35.96,48.26 L03B.P$1
  Top 0.61: C09B.2 33.57,48.26 | L02B.P$1 31.73,48.26 33.57,48.26 | 33.57,48.26 Q01B.3 | 33.53,50.55 33.53,54.61 J08B.1

### Text on the board
tNames: CD | MCU_TX / MCU_RX / +3V3 / NIL / GND | +3V3 TRST / MRST TCK / GND TMS | MCU_WKP | BM_OUT | VIN | CHG | +5V | SG / 50 | +22V | -20V | BM_BAT | + | P_SW | -15V | +15V | insert here
bNames: Designed in Singapore 07/15 / WiFi e-ink display v0.0.3 / Apache License 2.0 / @kennethlimcp | SG / 50